# Altium project Pollux III.PrjPcb (part 1 of 2)
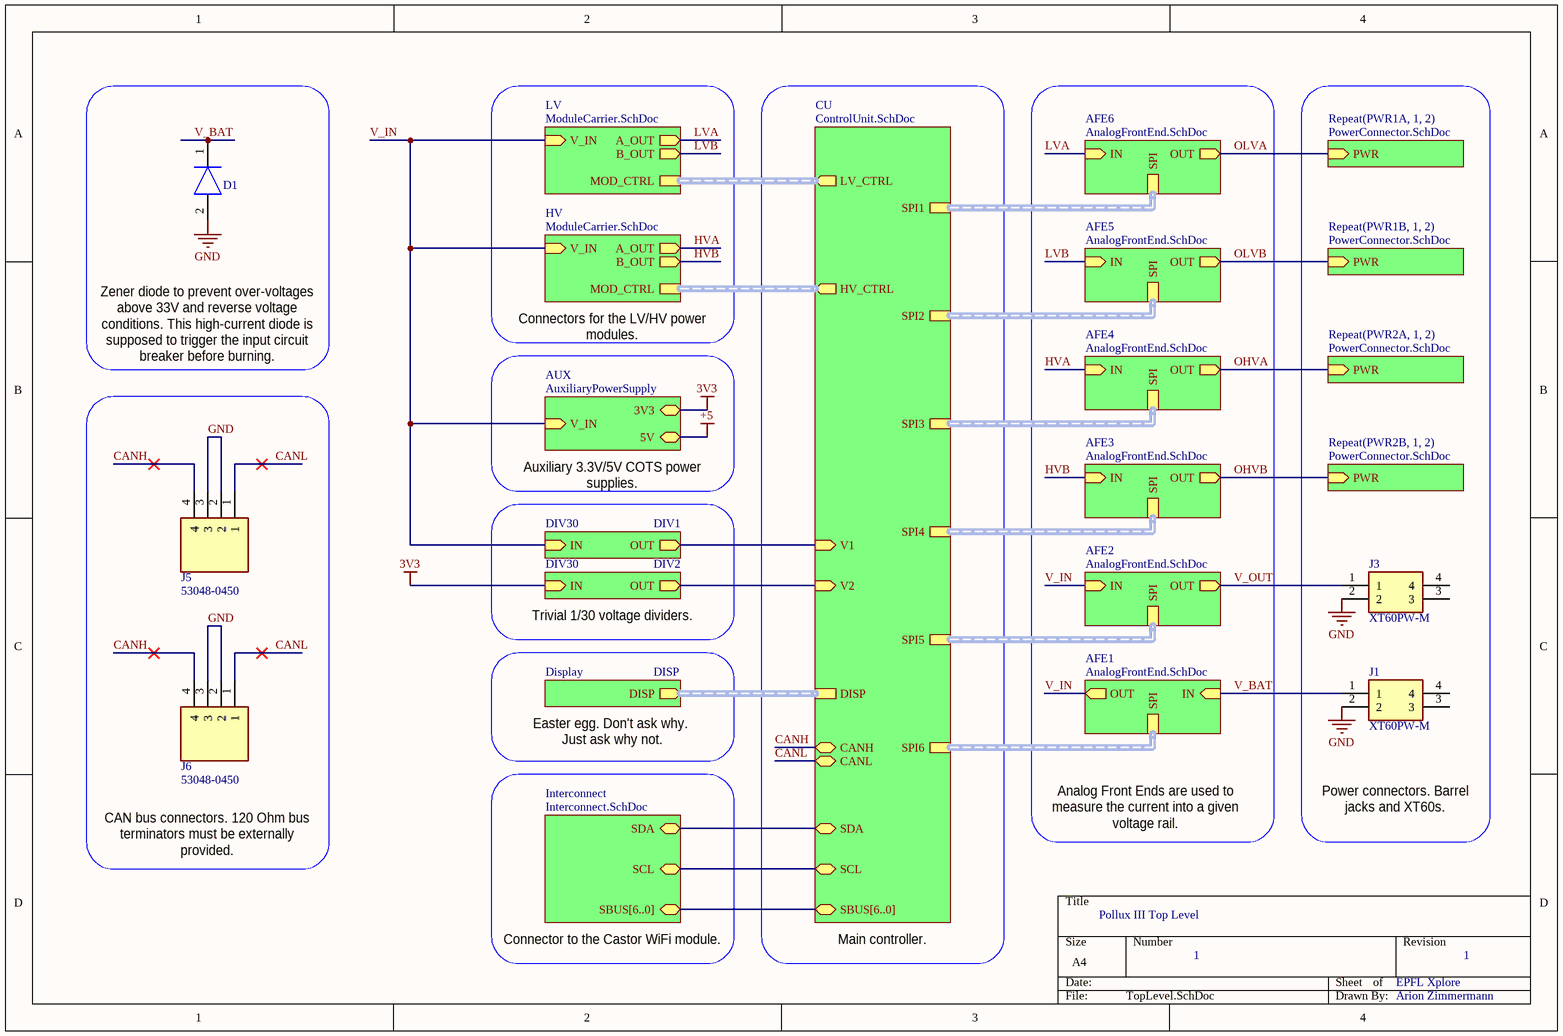
[diagram p0: TopLevel.SchDoc]
15 sheets, 118 parts. Net scope: hierarchical (ports join the sheet entries above them; power ports are global).
Board file: Pollux III.PcbDoc
Sheets:
  TopLevel.SchDoc
    LV = ModuleCarrier.SchDoc
    HV = ModuleCarrier.SchDoc
    CU = ControlUnit.SchDoc
      CTA = Controller.SchDoc
        FLASH = Flash.SchDoc
        CAN = CAN.SchDoc
        IMU = IMU.SchDoc
    DIV1 = DIV30.SchDoc
    DIV2 = DIV30.SchDoc
    AFE6 = AnalogFrontEnd.SchDoc
    PWR1A1 = PowerConnector.SchDoc
    PWR1A2 = PowerConnector.SchDoc
    PWR1B1 = PowerConnector.SchDoc
    PWR1B2 = PowerConnector.SchDoc
    PWR2A1 = PowerConnector.SchDoc
    PWR2A2 = PowerConnector.SchDoc
    PWR2B1 = PowerConnector.SchDoc
    PWR2B2 = PowerConnector.SchDoc
    AUX = AuxiliaryPowerSupply.SchDoc
    Interconnect = Interconnect.SchDoc
      LED_ST_R = LED.SchDoc
      LED_ST_G = LED.SchDoc
      LED_ST_B = LED.SchDoc
    AFE5 = AnalogFrontEnd.SchDoc
    AFE4 = AnalogFrontEnd.SchDoc
    AFE3 = AnalogFrontEnd.SchDoc
    AFE2 = AnalogFrontEnd.SchDoc
    AFE1 = AnalogFrontEnd.SchDoc
    DISP = Display.SchDoc
      AUDIO = Audio.SchDoc

## Sheet TopLevel.SchDoc
size A4; SheetNumber: 1; SheetTotal: 15

### Parts
D1  BZG03C33-HM3-08  [DIOM5127X229N]  (value not drawn)
J1  XT60PW-M  [XT60PWM]
J3  XT60PW-M  [XT60PWM]
J5  53048-0450  [SHDRRA4W35P0X125_1X4_675X550X350P]
J6  53048-0450  [SHDRRA4W35P0X125_1X4_675X550X350P]

### Sub-sheets
AFE1 = AnalogFrontEnd.SchDoc: IN (in), SPI (harness AFE_Harness), OUT (out)
AFE2 = AnalogFrontEnd.SchDoc: IN (in), SPI (harness AFE_Harness), OUT (out)
AFE3 = AnalogFrontEnd.SchDoc: IN (in), SPI (harness AFE_Harness), OUT (out)
AFE4 = AnalogFrontEnd.SchDoc: IN (in), SPI (harness AFE_Harness), OUT (out)
AFE5 = AnalogFrontEnd.SchDoc: IN (in), SPI (harness AFE_Harness), OUT (out)
AFE6 = AnalogFrontEnd.SchDoc: IN (in), SPI (harness AFE_Harness), OUT (out)
AUX = AuxiliaryPowerSupply: V_IN (in), 3V3 (bidir), 5V (bidir)
CU = ControlUnit.SchDoc: LV_CTRL (out, harness MOD_CTRL_Harness), V1 (in), V2 (in), SPI1 (harness AFE_Harness), SPI2 (harness AFE_Harness), SPI3 (harness AFE_Harness), SPI4 (harness AFE_Harness), SPI5 (harness AFE_Harness), SPI6 (harness AFE_Harness), SDA (bidir), SCL (bidir), SBUS[6..0] (bidir), CANH (bidir), CANL (bidir), HV_CTRL (out, harness MOD_CTRL_Harness), DISP (harness DISP_Harness)
DISP = Display: DISP (out, harness DISP_Harness)
DIV1 = DIV30: OUT (out), IN (in)
DIV2 = DIV30: OUT (out), IN (in)
HV = ModuleCarrier.SchDoc: A_OUT (out), V_IN (in), B_OUT (out), MOD_CTRL (harness MOD_CTRL_Harness)
Interconnect = Interconnect.SchDoc: SBUS[6..0] (bidir), SCL (bidir), SDA (bidir)
LV = ModuleCarrier.SchDoc: A_OUT (out), V_IN (in), B_OUT (out), MOD_CTRL (harness MOD_CTRL_Harness)
Repeat(PWR1A, 1, 2) = PowerConnector.SchDoc: PWR (in)
Repeat(PWR1B, 1, 2) = PowerConnector.SchDoc: PWR (in)
Repeat(PWR2A, 1, 2) = PowerConnector.SchDoc: PWR (in)
Repeat(PWR2B, 1, 2) = PowerConnector.SchDoc: PWR (in)

### Nets
3V3: sheet DIV2/IN, sheet AUX/3V3
GND: D1.2(A) J1.2 J3.2 J5.2 J5.3 J6.2 J6.3
CANH: J5.4 J6.4 ; sheet CU/CANH
CANL: J5.1 J6.1 ; sheet CU/CANL
HVA: sheet HV/A_OUT, sheet AFE4/IN
HVB: sheet HV/B_OUT, sheet AFE3/IN
LVA: sheet LV/A_OUT, sheet AFE6/IN
LVB: sheet LV/B_OUT, sheet AFE5/IN
OHVA: sheet Repeat(PWR2A, 1, 2)/PWR, sheet AFE4/OUT
OHVB: sheet Repeat(PWR2B, 1, 2)/PWR, sheet AFE3/OUT
OLVA: sheet AFE6/OUT, sheet Repeat(PWR1A, 1, 2)/PWR
OLVB: sheet Repeat(PWR1B, 1, 2)/PWR, sheet AFE5/OUT
SCL: sheet CU/SCL, sheet Interconnect/SCL
SDA: sheet CU/SDA, sheet Interconnect/SDA
V_BAT: D1.1(K) J1.1 ; sheet AFE1/IN
V_IN: sheet LV/V_IN, sheet HV/V_IN, sheet DIV1/IN, sheet AUX/V_IN, sheet AFE2/IN, sheet AFE1/OUT
V_OUT: J3.1 ; sheet AFE2/OUT
NetR9_DIV1_2: sheet CU/V1, sheet DIV1/OUT
NetR9_DIV2_2: sheet CU/V2, sheet DIV2/OUT

Not connected (* = marked no-connect by the designer): J1 3 4; J3 3 4

### Buses and harness runs
bus sheet CU/SBUS[6..0] = sheet Interconnect/SBUS[6..0]
harness sheet AFE1/SPI = sheet CU/SPI6
harness sheet AFE2/SPI = sheet CU/SPI5
harness sheet AFE3/SPI = sheet CU/SPI4
harness sheet AFE4/SPI = sheet CU/SPI3
harness sheet AFE5/SPI = sheet CU/SPI2
harness sheet AFE6/SPI = sheet CU/SPI1
harness sheet CU/DISP = sheet DISP/DISP
harness sheet CU/HV_CTRL = sheet HV/MOD_CTRL
harness sheet CU/LV_CTRL = sheet LV/MOD_CTRL

### Notes on the sheet
- Zener diode to prevent over-voltages above 33V and reverse voltage conditions. This high-current diode is supposed to trigger the input circuit breaker before burning.
- Connectors for the LV/HV power modules.
- Auxiliary 3.3V/5V COTS power supplies.
- Trivial 1/30 voltage dividers.
- Easter egg. Don't ask why.
  Just ask why not.
- Analog Front Ends are used to measure the current into a given voltage rail.
- Power connectors. Barrel jacks and XT60s.
- CAN bus connectors. 120 Ohm bus terminators must be externally provided.
- Pollux III Top Level
- Connector to the Castor WiFi module.
- Main controller.
- 1
- EPFL Xplore
- Arion Zimmermann

### Library data of the parts
D1 = BZG03C33-HM3-08: Diode; Manufacturer_Name: Vishay; Datasheet Link: https://www.arrow.com/en/products/bzg03c33-hm3-08/vishay; Height: 2.29mm; Manufacturer_Part_Number: BZG03C33-HM3-08; Mouser Part Number: 78-BZG03C33-HM3-08; Mouser Price/Stock: https://www.mouser.co.uk/ProductDetail/Vishay-Semiconductors/BZG03C33-HM3-08?qs=j%252B1pi9TdxUbhV%2FXINkfeTw%3D%3D; Arrow Part Number: BZG03C33-HM3-08; Arrow Price/Stock: https://www.arrow.com/en/products/bzg03c33-hm3-08/vishay
J1 J3 = XT60PW-M: Connector; Manufacturer_Name: Changzou Amass Elec; Datasheet Link: https://www.tme.eu/Document/9b8d0c5eb7094295f3d3112c214d3ade/XT60PW%20SPEC.pdf; Height: 8.4mm; Manufacturer_Part_Number: XT60PW-M
J5 J6 = 53048-0450: Connector; Manufacturer_Name: Molex; Datasheet Link: https://www.molex.com/pdm_docs/sd/530480450_sd.pdf; Height: 3.5mm; Manufacturer_Part_Number: 53048-0450; Mouser Part Number: 538-53048-0450; Mouser Price/Stock: https://www.mouser.co.uk/ProductDetail/Molex/53048-0450?qs=0lSvoLzn4L%252Bhzo05ywM78Q%3D%3D

## Sheet ModuleCarrier.SchDoc
size A4; SheetNumber: 2; SheetTotal: 15
Used 2 times, as channels LV, HV. Parts and nets are listed once, with the designators drawn on the sheet.
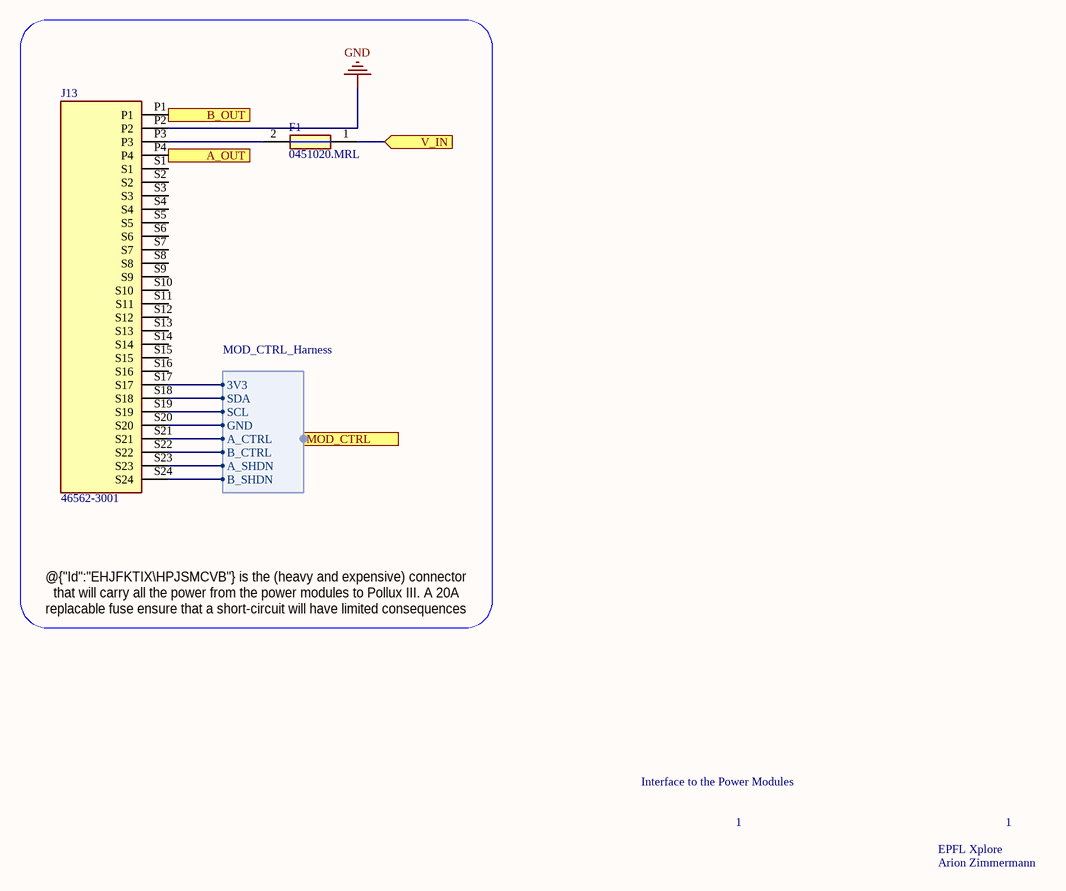
[diagram p1: ModuleCarrier.SchDoc]

### Parts
F1  0451020.MRL  [FUSC6127X294N]
J13  46562-3001  [465623001]

### Ports
A_OUT (out), B_OUT (out), MOD_CTRL (harness MOD_CTRL_Harness), V_IN (in)

### Harnesses
MOD_CTRL_Harness: B_SHDN, A_SHDN, B_CTRL, A_CTRL, GND, SCL, SDA, 3V3

### Nets
GND: J13.P2
A_OUT: J13.P4 ; port A_OUT
B_OUT: J13.P1 ; port B_OUT
V_IN: F1.1 ; port V_IN
NetF1_2: F1.2 J13.P3
NetJ13_S17: J13.S17 ; port MOD_CTRL.3V3
NetJ13_S18: J13.S18 ; port MOD_CTRL.SDA
NetJ13_S19: J13.S19 ; port MOD_CTRL.SCL
NetJ13_S20: J13.S20 ; port MOD_CTRL.GND
NetJ13_S21: J13.S21 ; port MOD_CTRL.A_CTRL
NetJ13_S22: J13.S22 ; port MOD_CTRL.B_CTRL
NetJ13_S23: J13.S23 ; port MOD_CTRL.A_SHDN
NetJ13_S24: J13.S24 ; port MOD_CTRL.B_SHDN

Not connected (* = marked no-connect by the designer): J13 S1 S2 S3 S4 S5 S6 S7 S8 S9 S10 S11 S12 S13 S14 S15 S16

### Channels
LV: designators end in _LV; ports A_OUT=LVA B_OUT=LVB V_IN=V_IN
HV: designators end in _HV; ports A_OUT=HVA B_OUT=HVB V_IN=V_IN

### Notes on the sheet
- @{"Id":"EHJFKTIX\HPJSMCVB"} is the (heavy and expensive) connector that will carry all the power from the power modules to Pollux III. A 20A replacable fuse ensure that a short-circuit will have limited consequences to the rest of the system.
- Interface to the Power Modules
- 1
- EPFL Xplore
- Arion Zimmermann

### Library data of the parts
F1 = 0451020.MRL: Fuse; Manufacturer_Name: LITTELFUSE; Datasheet Link: https://m.littelfuse.com/~/media/electronics/datasheets/fuses/littelfuse_fuse_451_453_datasheet.pdf.pdf; Height: 2.94mm; Manufacturer_Part_Number: 0451020.MRL; Mouser Part Number: 576-0451020.MRL; Mouser Price/Stock: https://www.mouser.co.uk/ProductDetail/Littelfuse/0451020MRL?qs=ZaMXuU%252B6JZZbQqgd%2F3uvYw%3D%3D; Arrow Part Number: 0451020.MRL; Arrow Price/Stock: https://www.arrow.com/en/products/0451020.mrl/littelfuse
J13 = 46562-3001: Connector; System: Connector

## Sheet ControlUnit.SchDoc
size A4; SheetNumber: 3; SheetTotal: 15
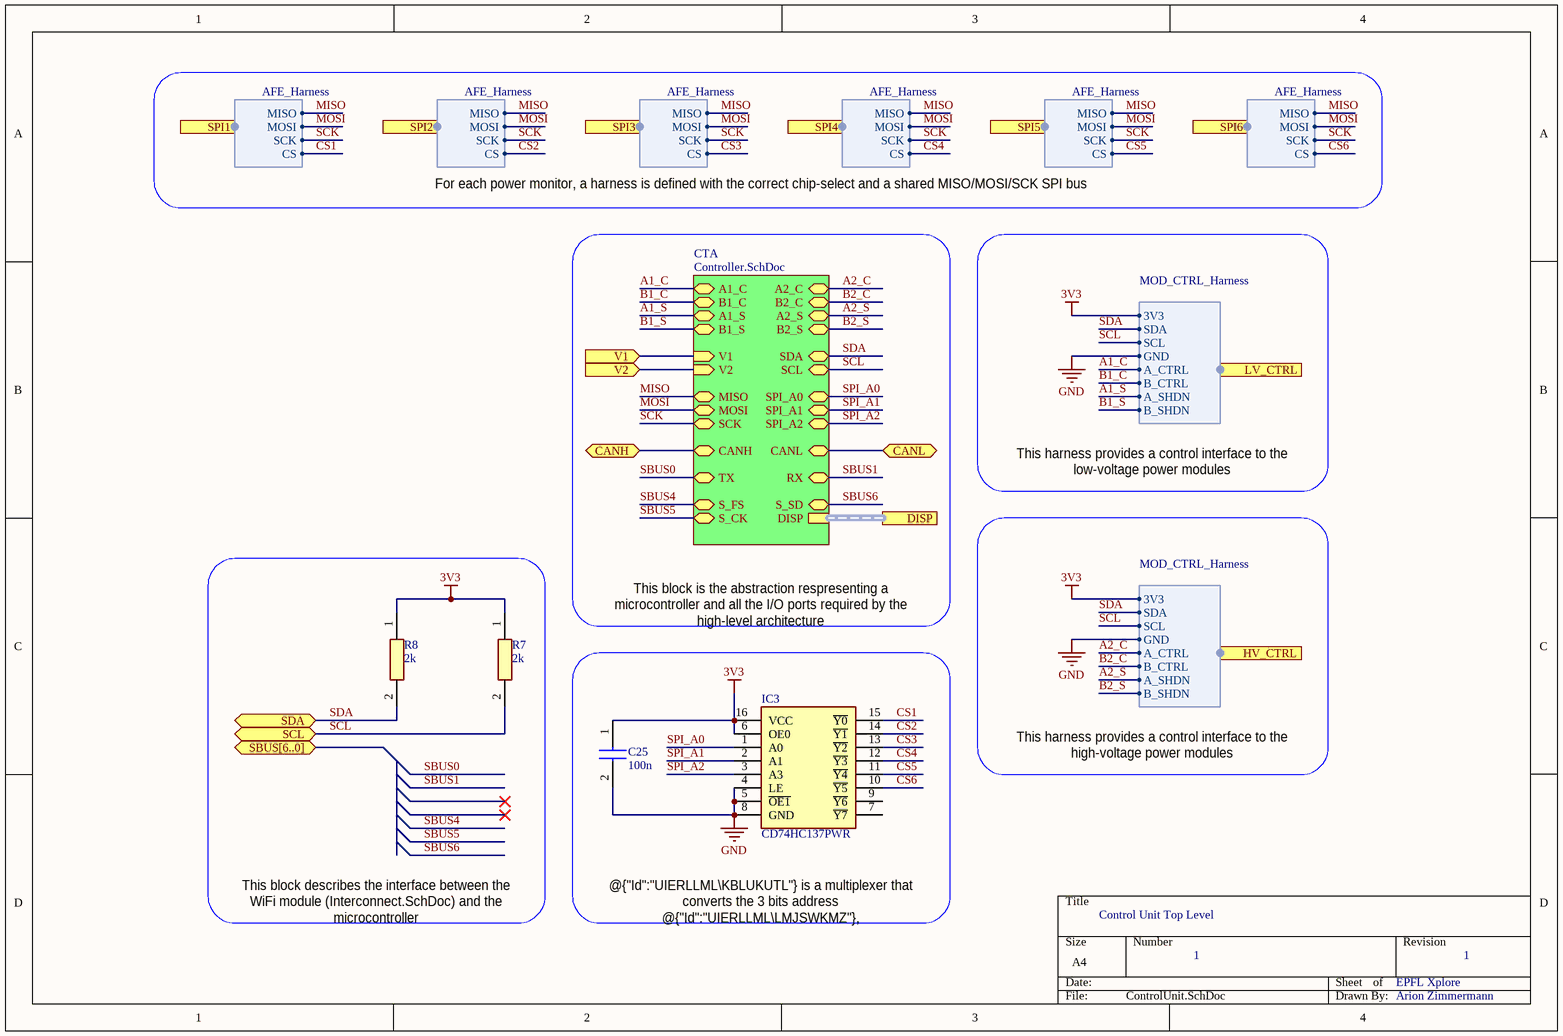
[diagram p2: ControlUnit.SchDoc]

### Parts
C25  value 100n  [CAPC1608X95N]  (hidden comment: C0603C104K5RACTU)
IC3  CD74HC137PWR  [SOP65P640X120-16N]
R7  value 2k  [RESC1608X50N]  (hidden comment: CRCW06032K00JNEB)
R8  value 2k  [RESC1608X50N]  (hidden comment: CRCW06032K00JNEB)

### Sub-sheets
CTA = Controller.SchDoc: V1 (in), V2 (in), SCL (bidir), SDA (bidir), B2_S (bidir), A2_S (bidir), B2_C (bidir), A2_C (bidir), RX (bidir), TX (bidir), MISO (bidir), MOSI (bidir), SCK (bidir), SPI_A1 (bidir), SPI_A2 (bidir), SPI_A0 (bidir), CANH (bidir), CANL (bidir), S_FS (bidir), S_CK (bidir), S_SD (bidir), B1_S (bidir), A1_S (bidir), B1_C (bidir), A1_C (bidir), DISP (harness DISP_Harness)

### Ports
CANH (bidir), CANL (bidir), DISP (harness DISP_Harness), HV_CTRL (harness MOD_CTRL_Harness), LV_CTRL (harness MOD_CTRL_Harness), SBUS[6..0] (bidir), SCL (bidir), SDA (bidir), SPI1 (harness AFE_Harness), SPI2 (harness AFE_Harness), SPI3 (harness AFE_Harness), SPI4 (harness AFE_Harness), SPI5 (harness AFE_Harness), SPI6 (harness AFE_Harness), V1 (in), V2 (in)

### Harnesses
AFE_Harness: MISO, MOSI, SCK, CS
MOD_CTRL_Harness: B_SHDN, A_SHDN, B_CTRL, A_CTRL, GND, SCL, SDA, 3V3

### Nets
3V3: C25.1 IC3.6(OE0) IC3.16(VCC) R7.1 R8.1 ; port LV_CTRL.3V3, port HV_CTRL.3V3
GND: C25.2 IC3.4(LE) IC3.5(~{OE1}) IC3.8(GND) ; port LV_CTRL.GND, port HV_CTRL.GND
A1_C: sheet CTA/A1_C, port LV_CTRL.A_CTRL
A1_S: sheet CTA/A1_S, port LV_CTRL.A_SHDN
A2_C: sheet CTA/A2_C, port HV_CTRL.A_CTRL
A2_S: sheet CTA/A2_S, port HV_CTRL.A_SHDN
B1_C: sheet CTA/B1_C, port LV_CTRL.B_CTRL
B1_S: sheet CTA/B1_S, port LV_CTRL.B_SHDN
B2_C: sheet CTA/B2_C, port HV_CTRL.B_CTRL
B2_S: sheet CTA/B2_S, port HV_CTRL.B_SHDN
CANH: port CANH, sheet CTA/CANH
CANL: port CANL, sheet CTA/CANL
CS1: IC3.15(~{Y0}) ; port SPI1.CS
CS2: IC3.14(~{Y1}) ; port SPI2.CS
CS3: IC3.13(~{Y2}) ; port SPI3.CS
CS4: IC3.12(~{Y3}) ; port SPI4.CS
CS5: IC3.11(~{Y4}) ; port SPI5.CS
CS6: IC3.10(~{Y5}) ; port SPI6.CS
MISO: sheet CTA/MISO, port SPI1.MISO, port SPI2.MISO, port SPI3.MISO, port SPI4.MISO, port SPI5.MISO, port SPI6.MISO
MOSI: sheet CTA/MOSI, port SPI1.MOSI, port SPI2.MOSI, port SPI3.MOSI, port SPI4.MOSI, port SPI5.MOSI, port SPI6.MOSI
SCK: sheet CTA/SCK, port SPI1.SCK, port SPI2.SCK, port SPI3.SCK, port SPI4.SCK, port SPI5.SCK, port SPI6.SCK
SCL: R7.2 ; port SCL, sheet CTA/SCL, port LV_CTRL.SCL, port HV_CTRL.SCL
SDA: R8.2 ; port SDA, sheet CTA/SDA, port LV_CTRL.SDA, port HV_CTRL.SDA
SPI_A0: IC3.1(A0) ; sheet CTA/SPI_A0
SPI_A1: IC3.2(A1) ; sheet CTA/SPI_A1
SPI_A2: IC3.3(A3) ; sheet CTA/SPI_A2
NetR9_DIV1_2: port V1, sheet CTA/V1
NetR9_DIV2_2: port V2, sheet CTA/V2

Not connected (* = marked no-connect by the designer): IC3 7(~{Y7}) 9(~{Y6})

### Buses and harness runs
harness port DISP = sheet CTA/DISP

### Notes on the sheet
- For each power monitor, a harness is defined with the correct chip-select and a shared MISO/MOSI/SCK SPI bus
- This harness provides a control interface to the low-voltage power modules
- This block is the abstraction respresenting a microcontroller and all the I/O ports required by the high-level architecture
- This harness provides a control interface to the high-voltage power modules
- This block describes the interface between the WiFi module (Interconnect.SchDoc) and the microcontroller
- @{"Id":"UIERLLML\KBLUKUTL"} is a multiplexer that converts the 3 bits address @{"Id":"UIERLLML\LMJSWKMZ"}, @{"Id":"UIERLLML\LQKXKBVL"}, @{"Id":"UIERLLML\IKBLSFXQ"} to a chip-select signal for the power monitors
- Control Unit Top Level
- 1
- EPFL Xplore
- Arion Zimmermann

### Library data of the parts
C25 = C0603C104K5RACTU: Capacitor; Manufacturer_Name: Kemet; Datasheet Link: http://www.farnell.com/datasheets/2205446.pdf; Height: 0.95mm; Manufacturer_Part_Number: C0603C104K5RACTU; Mouser Part Number: 80-C0603C104K5R; Mouser Price/Stock: https://www.mouser.co.uk/ProductDetail/KEMET/C0603C104K5RACTU?qs=l5k%252BbMnNDkkVcnZPSAaaiQ%3D%3D; Arrow Part Number: C0603C104K5RACTU; Arrow Price/Stock: https://www.arrow.com/en/products/c0603c104k5ractu/kemet-corporation; Supplier 1: Mouser; Supplier Part Number 1: 80-C0603C104K5R
IC3 = CD74HC137PWR: Integrated Circuit; Manufacturer_Name: Texas Instruments; Datasheet Link: http://www.ti.com/lit/gpn/cd74hc137; Height: 1.2mm; Manufacturer_Part_Number: CD74HC137PWR; Mouser Part Number: 595-CD74HC137PWR; Mouser Price/Stock: https://www.mouser.co.uk/ProductDetail/Texas-Instruments/CD74HC137PWR/?qs=YxwvVplHM%2Fm8ZkoHTCdntQ%3D%3D; Arrow Part Number: CD74HC137PWR; Arrow Price/Stock: https://www.arrow.com/en/products/cd74hc137pwr/texas-instruments; Supplier 1: Mouser; Supplier Part Number 1: 595-CD74HC137PWR
R7 R8 = CRCW0603931RFKEA: Resistor; Manufacturer_Name: Vishay; Manufacturer_Part_Number: CRCW0603787RFKEA; Datasheet Link: http://www.vishay.com/docs/20035/dcrcwe3.pdf; Height: 0.5mm; Supplier 1: Mouser; Supplier Part Number 1: 71-CRCW06032K00JNEB

## Sheet Controller.SchDoc
size A4; SheetNumber: 4; SheetTotal: 15
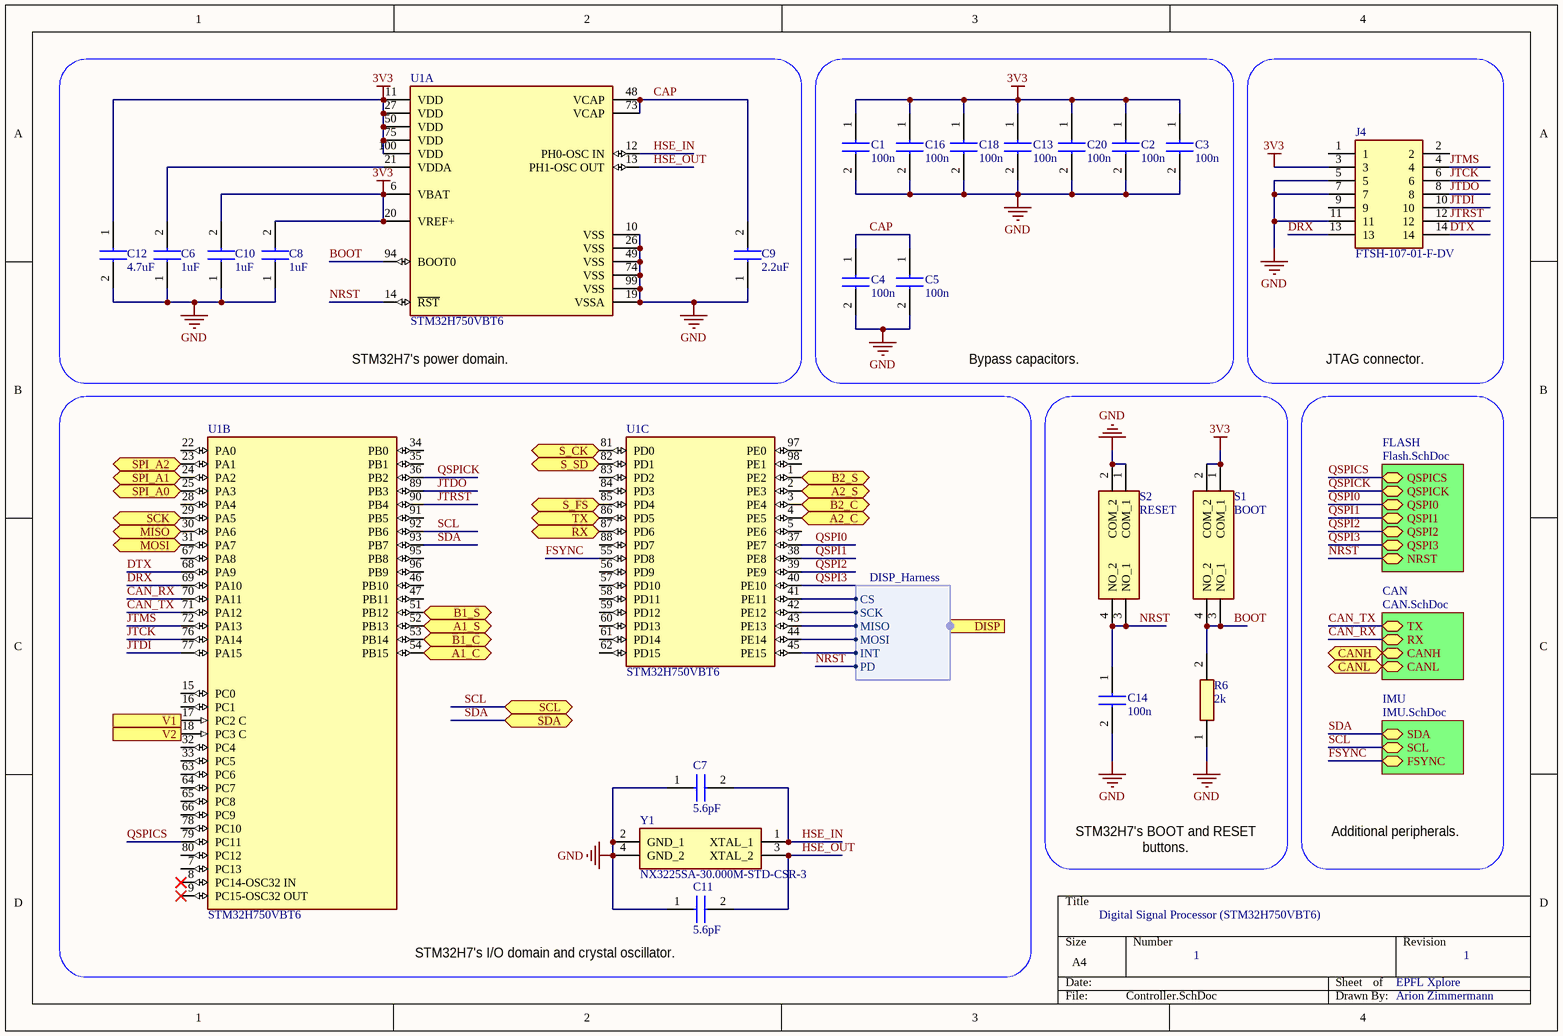
[diagram p3: Controller.SchDoc]

### Parts
C1  value 100n  [CAPC1608X95N]  (hidden comment: C0603C104K5RACTU)
C2  value 100n  [CAPC1608X95N]  (hidden comment: C0603C104K5RACTU)
C3  value 100n  [CAPC1608X95N]  (hidden comment: C0603C104K5RACTU)
C4  value 100n  [CAPC1608X95N]  (hidden comment: C0603C104K5RACTU)
C5  value 100n  [CAPC1608X95N]  (hidden comment: C0603C104K5RACTU)
C6  value 1uF  [CAPC3216X130N]  (hidden comment: C1206C105M5RECTU)
C7  value 5.6pF  [CAPC1608X87N]  (hidden comment: CBR06C569B5GAC)
C8  value 1uF  [CAPC3216X130N]  (hidden comment: C1206C105M5RECTU)
C9  value 2.2uF  [CAPC2012X140N]  (hidden comment: C0805C225K4REC7210)
C10  value 1uF  [CAPC3216X130N]  (hidden comment: C1206C105M5RECTU)
C11  value 5.6pF  [CAPC1608X87N]  (hidden comment: CBR06C569B5GAC)
C12  value 4.7uF  [CAPC2012X140N]  (hidden comment: C0805C475M4PACTU)
C13  value 100n  [CAPC1608X95N]  (hidden comment: C0603C104K5RACTU)
C14  value 100n  [CAPC1608X95N]  (hidden comment: C0603C104K5RACTU)
C16  value 100n  [CAPC1608X95N]  (hidden comment: C0603C104K5RACTU)
C18  value 100n  [CAPC1608X95N]  (hidden comment: C0603C104K5RACTU)
C20  value 100n  [CAPC1608X95N]  (hidden comment: C0603C104K5RACTU)
J4  FTSH-107-01-F-DV  [FTSH-107-XX-YYY-DV]
R6  value 2k  [RESC1608X50N]  (hidden comment: CRCW06032K00JNEB)
S1  BOOT  [LL3301FF065QJ]
S2  RESET  [LL3301FF065QJ]
U1  STM32H750VBT6  [FP-LQFP100-1L-MFG]  (parts A,B,C of 3)
Y1  NX3225SA-30.000M-STD-CSR-3  [NX2520SA192MHzEXS00ACS05400]

### Sub-sheets
CAN = CAN.SchDoc: TX (bidir), RX (bidir), CANH (bidir), CANL (bidir)
FLASH = Flash.SchDoc: QSPICS (bidir), QSPICK (bidir), QSPI0 (bidir), QSPI1 (bidir), QSPI2 (bidir), NRST (bidir), QSPI3 (bidir)
IMU = IMU.SchDoc: SDA (bidir), SCL (bidir), FSYNC (bidir)

### Ports
A1_C (bidir), A1_S (bidir), A2_C (bidir), A2_S (bidir), B1_C (bidir), B1_S (bidir), B2_C (bidir), B2_S (bidir), CANH (bidir), CANL (bidir), DISP (harness DISP_Harness), MISO (bidir), MOSI (bidir), RX (bidir), S_CK (bidir), S_FS (bidir), S_SD (bidir), SCK (bidir), SCL (bidir), SDA (bidir), SPI_A0 (bidir), SPI_A1 (bidir), SPI_A2 (bidir), TX (bidir), V1 (in), V2 (in)

### Harnesses
DISP_Harness: CS, MISO, SCK, MOSI, INT, PD

### Nets
3V3: C1.1 C2.1 C3.1 C8.2 C10.2 C12.1 C13.1 C16.1 C18.1 C20.1 J4.3 S1.1(COM_1) S1.2(COM_2) U1.6(VBAT) U1.11(VDD) U1.20(VREF+) U1.27(VDD) U1.50(VDD) U1.75(VDD) U1.100(VDD)
GND: C1.2 C2.2 C3.2 C4.2 C5.2 C6.1 C7.1 C8.1 C9.1 C10.1 C11.1 C12.2 C13.2 C14.2 C16.2 C18.2 C20.2 J4.5 J4.7 J4.11 R6.1 S2.1(COM_1) S2.2(COM_2) U1.10(VSS) U1.19(VSSA) U1.26(VSS) U1.49(VSS) U1.74(VSS) U1.99(VSS) Y1.2(GND_1) Y1.4(GND_2)
A1_C: U1.54(PB15) ; port A1_C
A1_S: U1.52(PB13) ; port A1_S
A2_C: U1.4(PE5) ; port A2_C
A2_S: U1.2(PE3) ; port A2_S
B1_C: U1.53(PB14) ; port B1_C
B1_S: U1.51(PB12) ; port B1_S
B2_C: U1.3(PE4) ; port B2_C
B2_S: U1.1(PE2) ; port B2_S
BOOT: R6.2 S1.3(NO_1) S1.4(NO_2) U1.94(BOOT0)
CAN_RX: U1.70(PA11) ; sheet CAN/RX
CAN_TX: U1.71(PA12) ; sheet CAN/TX
CANH: port CANH, sheet CAN/CANH
CANL: port CANL, sheet CAN/CANL
CAP: C4.1 C5.1 C9.2 U1.48(VCAP) U1.73(VCAP)
DCS: U1.41(PE11) ; port DISP.CS
DINT: U1.45(PE15) ; port DISP.INT
DMISO: U1.43(PE13) ; port DISP.MISO
DMOSI: U1.44(PE14) ; port DISP.MOSI
DRX: J4.13 U1.69(PA10)
DSCK: U1.42(PE12) ; port DISP.SCK
DTX: J4.14 U1.68(PA9)
FSYNC: U1.55(PD8) ; sheet IMU/FSYNC
HSE_IN: C7.2 U1.12(PH0-OSC_IN) Y1.1(XTAL_1)
HSE_OUT: C11.2 U1.13(PH1-OSC_OUT) Y1.3(XTAL_2)
JTCK: J4.6 U1.76(PA14)
JTDI: J4.10 U1.77(PA15)
JTDO: J4.8 U1.89(PB3)
JTMS: J4.4 U1.72(PA13)
JTRST: J4.12 U1.90(PB4)
MISO: U1.30(PA6) ; port MISO
MOSI: U1.31(PA7) ; port MOSI
NRST: C14.1 S2.3(NO_1) S2.4(NO_2) U1.14(~{RST}) ; sheet FLASH/NRST, port DISP.PD
QSPI0: U1.37(PE7) ; sheet FLASH/QSPI0
QSPI1: U1.38(PE8) ; sheet FLASH/QSPI1
QSPI2: U1.39(PE9) ; sheet FLASH/QSPI2
QSPI3: U1.40(PE10) ; sheet FLASH/QSPI3
QSPICK: U1.36(PB2) ; sheet FLASH/QSPICK
QSPICS: U1.79(PC11) ; sheet FLASH/QSPICS
SBUS0: U1.86(PD5) ; port TX
SBUS1: U1.87(PD6) ; port RX
SBUS4: U1.85(PD4) ; port S_FS
SBUS5: U1.81(PD0) ; port S_CK
SBUS6: U1.82(PD1) ; port S_SD
SCK: U1.29(PA5) ; port SCK
SCL: U1.92(PB6) ; port SCL, sheet IMU/SCL
SDA: U1.93(PB7) ; port SDA, sheet IMU/SDA
SPI_A0: U1.25(PA3) ; port SPI_A0
SPI_A1: U1.24(PA2) ; port SPI_A1
SPI_A2: U1.23(PA1) ; port SPI_A2
NetC6_2: C6.2 U1.21(VDDA)
NetR9_DIV1_2: U1.17(PC2_C) ; port V1
NetR9_DIV2_2: U1.18(PC3_C) ; port V2

Not connected (* = marked no-connect by the designer): J4 1 2 9; U1 5(PE6) 7(PC13) 8(PC14-OSC32_IN)* 9(PC15-OSC32_OUT)* 15(PC0) 16(PC1) 22(PA0) 28(PA4) 32(PC4) 33(PC5) 34(PB0) 35(PB1) 46(PB10) 47(PB11) 56(PD9) 57(PD10) 58(PD11) 59(PD12) 60(PD13) 61(PD14) 62(PD15) 63(PC6) 64(PC7) 65(PC8) 66(PC9) 67(PA8) 78(PC10) 80(PC12) 83(PD2) 84(PD3) 88(PD7) 91(PB5) 95(PB8) 96(PB9) 97(PE0) 98(PE1)

### Notes on the sheet
- (near U1) STM32H7's power domain.
- Bypass capacitors.
- JTAG connector.
- STM32H7's BOOT and RESET buttons.
- Additional peripherals.
- Digital Signal Processor (STM32H750VBT6)
- STM32H7's I/O domain and crystal oscillator.
- 1
- EPFL Xplore
- Arion Zimmermann

### Library data of the parts
C1-C5 C13 C14 C16 C18 C20 = C0603C104K5RACTU: Capacitor; Manufacturer_Name: Kemet; Datasheet Link: http://www.farnell.com/datasheets/2205446.pdf; Height: 0.95mm; Manufacturer_Part_Number: C0603C104K5RACTU; Mouser Part Number: 80-C0603C104K5R; Mouser Price/Stock: https://www.mouser.co.uk/ProductDetail/KEMET/C0603C104K5RACTU?qs=l5k%252BbMnNDkkVcnZPSAaaiQ%3D%3D; Arrow Part Number: C0603C104K5RACTU; Arrow Price/Stock: https://www.arrow.com/en/products/c0603c104k5ractu/kemet-corporation; Supplier 1: Mouser; Supplier Part Number 1: 80-C0603C104K5R
C6 C8 C10 = C1206C105M5RECTU: Capacitor; Manufacturer_Name: Kemet; Datasheet Link: https://content.kemet.com/datasheets/KEM_C1090_X7R_ESD.pdf; Height: 1.3mm; Manufacturer_Part_Number: C1206C105M5RECTU; Mouser Part Number: 80-C1206C105M5RECTU; Mouser Price/Stock: https://www.mouser.co.uk/ProductDetail/KEMET/C1206C105M5RECTU?qs=55YtniHzbhBh39CxZCw85g%3D%3D; Arrow Part Number: C1206C105M5RECTU; Arrow Price/Stock: https://www.arrow.com/en/products/c1206c105m5rectu/kemet-corporation; Supplier 1: Mouser; Supplier Part Number 1: 80-C1206C105M5RECTU
C7 C11 = CBR06C569B5GAC: Capacitor; Manufacturer_Name: Kemet; Datasheet Link: http://www.kemet.com/Lists/ProductCatalog/Attachments/490/KEM_C1030_CBR_SMD.pdf; Height: 0.87mm; Manufacturer_Part_Number: CBR06C569B5GAC; Mouser Part Number: 80-CBR06C569B5GAC; Mouser Price/Stock: https://www.mouser.co.uk/ProductDetail/KEMET/CBR06C569B5GAC/?qs=8sjaHP9aayqGSwkvsyWeEw%3D%3D; Arrow Part Number: CBR06C569B5GAC; Arrow Price/Stock: https://www.arrow.com/en/products/cbr06c569b5gac/kemet-corporation; Supplier 1: Mouser; Supplier Part Number 1: 80-CBR06C569B5GAC
C9 = C0805C225K4REC7210: Capacitor; Manufacturer_Name: Kemet; Datasheet Link: https://content.kemet.com/datasheets/KEM_C1090_X7R_ESD.pdf; Height: 1.4mm; Manufacturer_Part_Number: C0805C225K4REC7210; Mouser Part Number: 80-C0805C225K4RECLR; Mouser Price/Stock: https://www.mouser.co.uk/ProductDetail/KEMET/C0805C225K4REC7210?qs=55YtniHzbhCWJdUu8xFadQ%3D%3D; Supplier 1: Mouser; Supplier Part Number 1: 80-C0805C225K4RECLR
C12 = C0805C475J4RACAUTO: Capacitor; Manufacturer_Name: Kemet; Datasheet Link: https://componentsearchengine.com/Datasheets/1/C0805C475J4RACAUTO.pdf; Height: 1.4mm; Manufacturer_Part_Number: C0805C475J4RACAUTO; Mouser Part Number: 80-C0805C475J4RAUTO; Mouser Price/Stock: https://www.mouser.co.uk/ProductDetail/KEMET/C0805C475J4RACAUTO?qs=HXFqYaX1Q2zgZ196jUXcdQ%3D%3D; Arrow Part Number: C0805C475J4RACAUTO; Arrow Price/Stock: https://www.arrow.com/en/products/c0805c475j4racauto/kemet-corporation; Supplier 1: Mouser; Supplier Part Number 1: 80-C0805C475J4RAUTO
J4 = FTSH-107-01-F-DV: Connector; Manufacturer_Name: SAMTEC; Datasheet Link: http://suddendocs.samtec.com/prints/ftsh-1xx-xx-xxx-dv-xxx-xxx-mkt.pdf; Manufacturer_Part_Number: FTSH-107-01-F-DV; Mouser Part Number: 200-FTSH10701FDV; Mouser Price/Stock: https://www.mouser.co.uk/ProductDetail/Samtec/FTSH-107-01-F-DV?qs=0lQeLiL1qyalhkvT7SJ4Kw%3D%3D; Arrow Part Number: FTSH-107-01-F-DV; Arrow Price/Stock: https://www.arrow.com/en/products/ftsh-107-01-f-dv/samtec; Supplier 1: Mouser; Supplier Part Number 1: 200-FTSH10701FDV
R6 = CRCW0603931RFKEA: as R7 on sheet ControlUnit; Datasheet Link: http://www.vishay.com/docs/20035/dcrcwe3.pdf; Height: 0.5mm; Supplier 1: Mouser; Supplier Part Number 1: 71-CRCW06032K00JNEB
S1 S2 = LL3301AF065QJ: Switch; Manufacturer_Name: E-Switch; Datasheet Link: https://media.digikey.com/pdf/Data%20Sheets/E-Switch%20PDFs/LL3301AF065QJ.pdf; Height: 7.3mm; Manufacturer_Part_Number: LL3301AF065QJ; Mouser Part Number: 612-LL3301AF065QJ; Mouser Price/Stock: https://www.mouser.co.uk/ProductDetail/E-Switch/LL3301AF065QJ?qs=QtyuwXswaQi68RkbBY57jQ%3D%3D; Supplier 1: Mouser; Supplier Part Number 1: 612-LL3301AF065QJ
U1 = CMP-12105-000017-1: IC MCU 32BIT 128KB FLASH 100LQFP; Manufacturer: STMicroelectronics; Number Of Uart Channels: 9; Number Of I/Os: 82; Max Junction Temp: +125°C; Data Bus Width: 32bits; Ram Size: 1MBytes; Min Supply Voltage: 1.62V; Number Of Spi Channels: 6; Number Of Adc Channels: 36; Max Supply Voltage: 3.6V; Standoff Height: 0.05mm; Interface: I2C,SPI,UART,USART,CAN,USB,LIN,IrDA,Ethernet,I2S,Other; Number Of A/D Converters: 3; Number Of I2C Channels: 4; Memory Size: 128KBytes; Frequency: 480MHz; Number Of Timers/Counters: 20; Number Of Ethernet Channels: 1; Core Architecture: ARM Cortex-M7; Number Of Usb Channels: 2; Number Of Pwm Channels: 42; Ambient Temperature Range High: +85°C; Temperature: -40°C to +125°C; ComponentLink2URL: https://www.st.com/resource/en/datasheet/stm32h750vb.pdf; Device Class L2: Embedded Processors and Controllers; Temperature Range Low: -40°C; Octopart: https://octopart.com/stm32h750vbt6-stmicroelectronics-94048547; Category: IC; Manufacturer Part Number: STM32H750VBT6; Height: 1.6mm; Lead Free: Yes; Device Class L1: Integrated Circuits (ICs); Digikey Description: IC MCU 32BIT 128KB FLASH 100LQFP; RoHS: TRUE; Ambient Temperature Range Low: -40°C; Device Class L3: Microcontrollers; ComponentLink2Description: Datasheet; Mouser Description: MCU 32-Bit STM32H750VB ARM Cortex M7 RISC 128KB Flash 1.8V/2.5V/3.3V 100-Pin LQFP Tray; Number Of Cores: 1; Automotive: No; Memory Type: FLASH; Package: LQFP100-1L; Temperature Range High: +125°C
Y1 = NX2520SA-25.000M-STD-CSW-5: Crystal or Oscillator; Manufacturer_Name: NDK; Datasheet Link: https://kr.mouser.com/datasheet/2/905/ndk_08142018_NX2520SA-19.200000MHZ-NBG1-1389014.pdf; Height: 0.55mm; Manufacturer_Part_Number: NX2520SA-25.000M-STD-CSW-5; Mouser Part Number: 344-NX2520SA25MSTSW5; Mouser Price/Stock: https://www.mouser.co.uk/ProductDetail/NDK/NX2520SA-25000M-STD-CSW-5?qs=w%2Fv1CP2dgqoYJPVY2dD4UA%3D%3D; Supplier 1: Mouser; Supplier Part Number 1: 344-NX3225SA30MSTSR3

## Sheet Flash.SchDoc
size A4; SheetNumber: 6; SheetTotal: 15
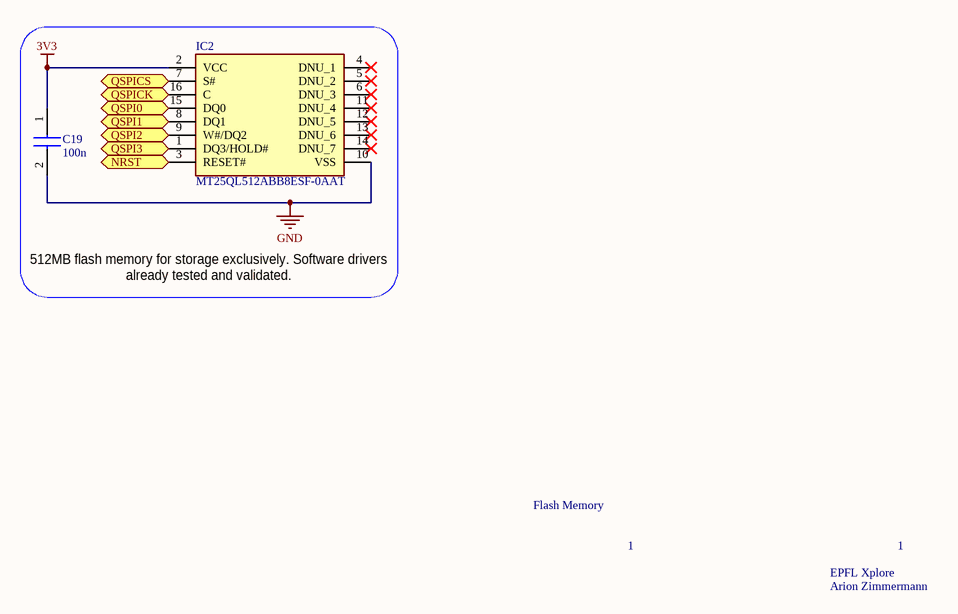
[diagram p4: Flash.SchDoc]

### Parts
C19  value 100n  [CAPC1608X95N]  (hidden comment: C0603C104K5RACTU)
IC2  MT25QL512ABB8ESF-0AAT  [SOIC127P1032X265-16N]

### Ports
NRST (bidir), QSPI0 (bidir), QSPI1 (bidir), QSPI2 (bidir), QSPI3 (bidir), QSPICK (bidir), QSPICS (bidir)

### Nets
3V3: C19.1 IC2.2(VCC)
GND: C19.2 IC2.10(VSS)
NRST: IC2.3(RESET#) ; port NRST
QSPI0: IC2.15(DQ0) ; port QSPI0
QSPI1: IC2.8(DQ1) ; port QSPI1
QSPI2: IC2.9(W#/DQ2) ; port QSPI2
QSPI3: IC2.1(DQ3/HOLD#) ; port QSPI3
QSPICK: IC2.16(C) ; port QSPICK
QSPICS: IC2.7(S#) ; port QSPICS

Not connected (* = marked no-connect by the designer): IC2 4(DNU_1)* 5(DNU_2)* 6(DNU_3)* 11(DNU_4)* 12(DNU_5)* 13(DNU_6)* 14(DNU_7)*

### Notes on the sheet
- 512MB flash memory for storage exclusively. Software drivers already tested and validated.
- Flash Memory
- 1
- EPFL Xplore
- Arion Zimmermann

### Library data of the parts
C19 = C0603C104K5RACTU: Capacitor; Manufacturer_Name: Kemet; Datasheet Link: http://www.farnell.com/datasheets/2205446.pdf; Height: 0.95mm; Manufacturer_Part_Number: C0603C104K5RACTU; Mouser Part Number: 80-C0603C104K5R; Mouser Price/Stock: https://www.mouser.co.uk/ProductDetail/KEMET/C0603C104K5RACTU?qs=l5k%252BbMnNDkkVcnZPSAaaiQ%3D%3D; Arrow Part Number: C0603C104K5RACTU; Arrow Price/Stock: https://www.arrow.com/en/products/c0603c104k5ractu/kemet-corporation; Supplier 1: Mouser; Supplier Part Number 1: 80-C0603C104K5R
IC2 = MT25QL512ABB8ESF-0AAT: Integrated Circuit; Manufacturer_Name: Micron; Datasheet Link: https://media-www.micron.com/-/media/client/global/documents/products/data-sheet/nor-flash/serial-nor/mt25q/die-rev-b/mt25q_qlkt_l_512_abb_0.pdf?rev=0ef0faa5f7b645d7bc11c30bfd27505b; Height: 2.65mm; Manufacturer_Part_Number: MT25QL512ABB8ESF-0AAT; Mouser Part Number: 340-285789-TRAY; Mouser Price/Stock: https://www.mouser.co.uk/ProductDetail/Micron/MT25QL512ABB8ESF-0AAT?qs=rrS6PyfT74da2PZ8DoLIJg%3D%3D; Arrow Part Number: MT25QL512ABB8ESF-0AAT; Arrow Price/Stock: https://www.arrow.com/en/products/mt25ql512abb8esf-0aat/micron-technology; Supplier 1: Mouser; Supplier Part Number 1: 340-285789-TRAY

## Sheet CAN.SchDoc
size A4; SheetNumber: 7; SheetTotal: 15
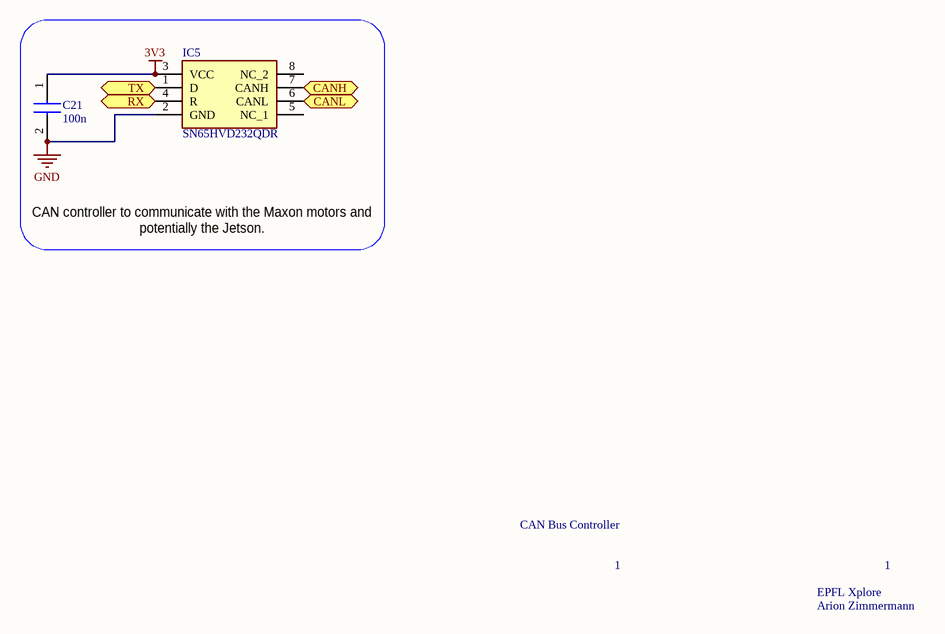
[diagram p5: CAN.SchDoc]

### Parts
C21  value 100n  [CAPC1608X95N]  (hidden comment: C0603C104K5RACTU)
IC5  SN65HVD232QDR  [SOIC127P600X175-8N]

### Ports
CANH (bidir), CANL (bidir), RX (bidir), TX (bidir)

### Nets
3V3: C21.1 IC5.3(VCC)
GND: C21.2 IC5.2(GND)
CAN_RX: IC5.4(R) ; port RX
CAN_TX: IC5.1(D) ; port TX
CANH: IC5.7(CANH) ; port CANH
CANL: IC5.6(CANL) ; port CANL

Not connected (* = marked no-connect by the designer): IC5 5(NC_1) 8(NC_2)

### Notes on the sheet
- CAN controller to communicate with the Maxon motors and potentially the Jetson.
- CAN Bus Controller
- 1
- EPFL Xplore
- Arion Zimmermann

### Library data of the parts
C21 = C0603C104K5RACTU: Capacitor; Manufacturer_Name: Kemet; Datasheet Link: http://www.farnell.com/datasheets/2205446.pdf; Height: 0.95mm; Manufacturer_Part_Number: C0603C104K5RACTU; Mouser Part Number: 80-C0603C104K5R; Mouser Price/Stock: https://www.mouser.co.uk/ProductDetail/KEMET/C0603C104K5RACTU?qs=l5k%252BbMnNDkkVcnZPSAaaiQ%3D%3D; Arrow Part Number: C0603C104K5RACTU; Arrow Price/Stock: https://www.arrow.com/en/products/c0603c104k5ractu/kemet-corporation; Supplier 1: Mouser; Supplier Part Number 1: 80-C0603C104K5R
IC5 = SN65HVD232QDR: Integrated Circuit; Manufacturer_Name: Texas Instruments; Datasheet Link: http://www.ti.com/lit/gpn/SN65HVD232Q; Height: 1.75mm; Manufacturer_Part_Number: SN65HVD232QDR; Mouser Part Number: 595-SN65HVD232QDR; Mouser Price/Stock: https://www.mouser.co.uk/ProductDetail/Texas-Instruments/SN65HVD232QDR?qs=QViXGNcIEAuDpfsGPShang%3D%3D; Arrow Part Number: SN65HVD232QDR; Arrow Price/Stock: https://www.arrow.com/en/products/sn65hvd232qdr/texas-instruments?region=nac

## Sheet IMU.SchDoc
size A4; SheetNumber: 5; SheetTotal: 15
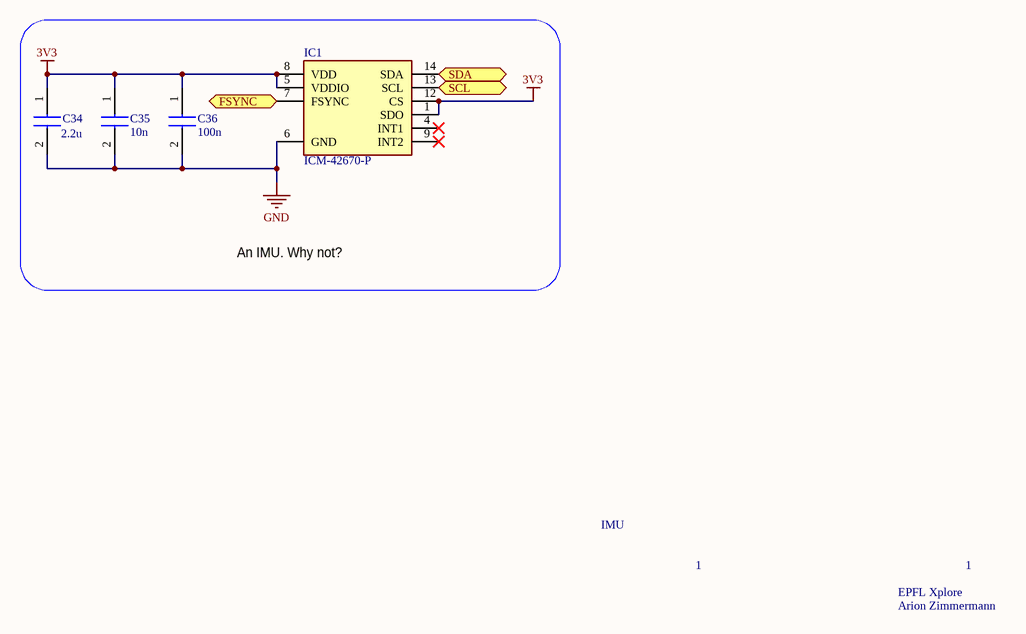
[diagram p6: IMU.SchDoc]

### Parts
C34  value 2.2u  [C1206]  (hidden comment: C1206J225J4RACAUTO)
C35  value 10n  [CAPC1608X95N]  (hidden comment: C0603C103K5RACTU)
C36  value 100n  [CAPC1608X95N]  (hidden comment: C0603C104K5RACTU)
IC1  ICM-42670-P  [ICM42670P]

### Ports
FSYNC (bidir), SCL (bidir), SDA (bidir)

### Nets
3V3: C34.1 C35.1 C36.1 IC1.1(SDO) IC1.5(VDDIO) IC1.8(VDD) IC1.12(CS)
GND: C34.2 C35.2 C36.2 IC1.6(GND)
FSYNC: IC1.7(FSYNC) ; port FSYNC
SCL: IC1.13(SCL) ; port SCL
SDA: IC1.14(SDA) ; port SDA

Not connected (* = marked no-connect by the designer): IC1 4(INT1)* 9(INT2)*

### Notes on the sheet
- An IMU. Why not?
- IMU
- 1
- EPFL Xplore
- Arion Zimmermann

### Library data of the parts
C34 = C1206C106K4RACTU: Capacitor; Manufacturer_Name: Kemet; Datasheet Link: https://content.kemet.com/datasheets/KEM_C1002_X7R_SMD.pdf; Manufacturer_Part_Number: C1206C106K4RACTU; Mouser Part Number: 80-C1206C106K4R; Mouser Price/Stock: https://www.mouser.co.uk/ProductDetail/KEMET/C1206C106K4RACTU?qs=guDyKOyRtV0mxqxQedB7kA%3D%3D; Arrow Part Number: C1206C106K4RACTU; Arrow Price/Stock: https://www.arrow.com/en/products/c1206c106k4ractu/kemet-corporation
C35 C36 = C0603C104K5RACTU: Capacitor; Manufacturer_Name: Kemet; Datasheet Link: http://www.farnell.com/datasheets/2205446.pdf; Height: 0.95mm; Manufacturer_Part_Number: C0603C104K5RACTU; Mouser Part Number: 80-C0603C104K5R; Mouser Price/Stock: https://www.mouser.co.uk/ProductDetail/KEMET/C0603C104K5RACTU?qs=l5k%252BbMnNDkkVcnZPSAaaiQ%3D%3D; Arrow Part Number: C0603C104K5RACTU; Arrow Price/Stock: https://www.arrow.com/en/products/c0603c104k5ractu/kemet-corporation; Supplier 1: Mouser; Supplier Part Number 1: 80-C0603C104K5R
IC1 = ICM-42670-P: Integrated Circuit; Manufacturer_Name: TDK; Datasheet Link: https://3cfeqx1hf82y3xcoull08ihx-wpengine.netdna-ssl.com/wp-content/uploads/2021/07/DS-000451-ICM-42670-P-v1.0.pdf; Manufacturer_Part_Number: ICM-42670-P; Mouser Part Number: 410-ICM-42670-P; Mouser Price/Stock: https://www.mouser.co.uk/ProductDetail/TDK-InvenSense/ICM-42670-P?qs=iLbezkQI%252BsgK8sMF5V7fQQ%3D%3D; Arrow Part Number: ICM-42670-P; Arrow Price/Stock: https://www.arrow.com/en/products/icm-42670-p/invensense?region=nac

## Sheet DIV30.SchDoc
size A4; SheetNumber: 8; SheetTotal: 15
Used 2 times, as channels DIV1, DIV2. Parts and nets are listed once, with the designators drawn on the sheet.
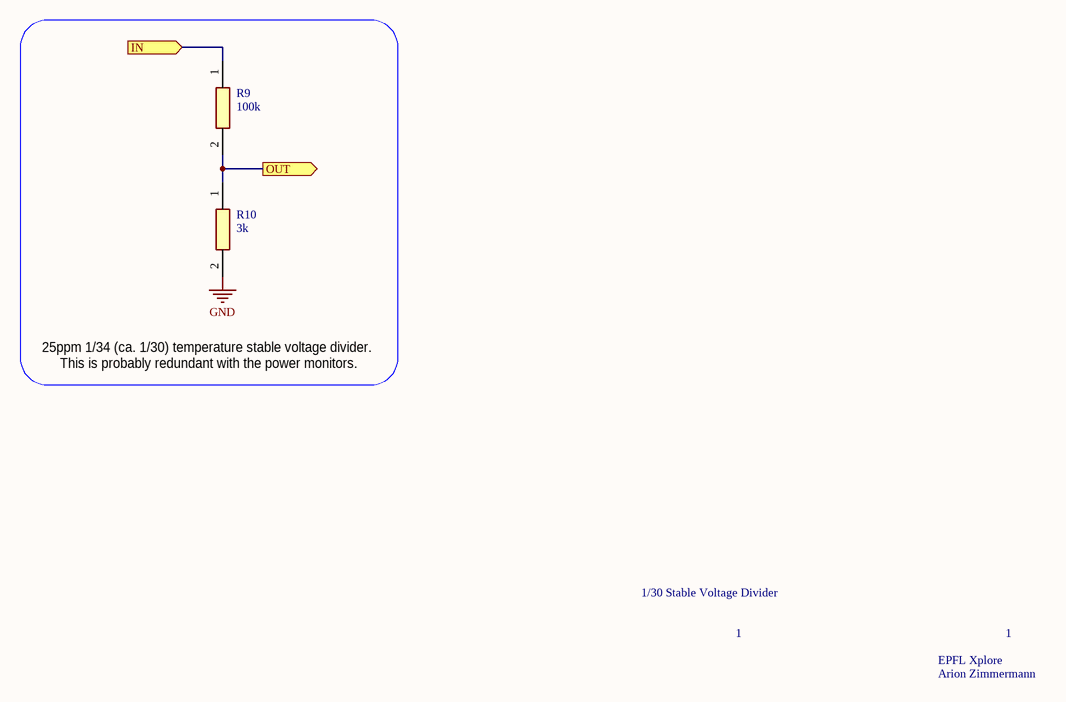
[diagram p7: DIV30.SchDoc]

### Parts
R9  value 100k  [RESC1608X55N]  (hidden comment: TNPW0603100KBEEA)
R10  value 3k  [RESC1608X55N]  (hidden comment: TNPW06033K00BEEA)

### Ports
IN (in), OUT (out)

### Nets
GND: R10.2
IN: R9.1 ; port IN
OUT: R9.2 R10.1 ; port OUT

### Channels
DIV1: designators end in _DIV1; ports IN=V_IN OUT=NetR9_DIV1_2
DIV2: designators end in _DIV2; ports IN=3V3 OUT=NetR9_DIV2_2

### Notes on the sheet
- 25ppm 1/34 (ca. 1/30) temperature stable voltage divider.
  This is probably redundant with the power monitors.
- 1/30 Stable Voltage Divider
- 1
- EPFL Xplore
- Arion Zimmermann

### Library data of the parts
R9 = TNPW0603100KBEEA: Resistor; Manufacturer_Name: Vishay; Datasheet Link: https://datasheet.datasheetarchive.com/originals/distributors/DKDS41/DSANUWW0030147.pdf; Height: 0.55mm; Manufacturer_Part_Number: TNPW0603100KBEEA
R10 = TNPW06033K00BEEA: Resistor; Manufacturer_Name: Vishay; Datasheet Link: http://www.vishay.com/docs/28758/tnpw_e3.pdf; Height: 0.55mm; Manufacturer_Part_Number: TNPW06033K00BEEA; Mouser Part Number: 71-TNPW06033K00BEEA; Mouser Price/Stock: https://www.mouser.co.uk/ProductDetail/Vishay-Dale/TNPW06033K00BEEA?qs=kHCK1FE53PnaIDT%252BQ71GHQ%3D%3D

## Sheet AnalogFrontEnd.SchDoc
size A4; SheetNumber: 9; SheetTotal: 15
Used 6 times, as channels AFE6, AFE5, AFE4, AFE3, AFE2, AFE1. Parts and nets are listed once, with the designators drawn on the sheet.
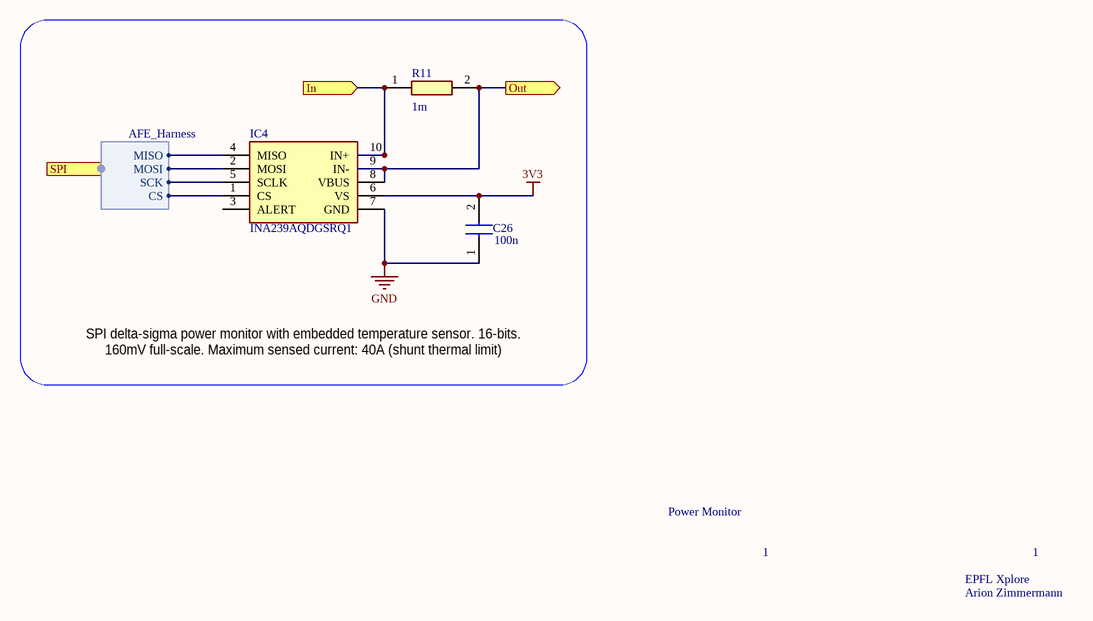
[diagram p8: AnalogFrontEnd.SchDoc]

### Parts
C26  value 100n  [CAPC1608X95N]  (hidden comment: C0603C104K5RACTU)
IC4  INA239AQDGSRQ1  [SOP50P490X110-10N]
R11  value 1m  [RESC6430X90N]  (hidden comment: PCS2512FR0010ET)

### Ports
In (in), Out (out), SPI (harness AFE_Harness)

### Harnesses
AFE_Harness: SCK, MISO, MOSI, CS

### Nets
3V3: C26.2 IC4.6(VS)
GND: C26.1 IC4.7(GND)
In: IC4.10(IN+) R11.1 ; port In
Out: IC4.8(VBUS) IC4.9(IN-) R11.2 ; port Out
NetIC4_1: IC4.1(CS) ; port SPI.CS
NetIC4_2: IC4.2(MOSI) ; port SPI.MOSI
NetIC4_4: IC4.4(MISO) ; port SPI.MISO
NetIC4_5: IC4.5(SCLK) ; port SPI.SCK

Not connected (* = marked no-connect by the designer): IC4 3(ALERT)

### Channels
AFE6: designators end in _AFE6; ports In=LVA Out=OLVA
AFE5: designators end in _AFE5; ports In=LVB Out=OLVB
AFE4: designators end in _AFE4; ports In=HVA Out=OHVA
AFE3: designators end in _AFE3; ports In=HVB Out=OHVB
AFE2: designators end in _AFE2; ports In=V_IN Out=V_OUT
AFE1: designators end in _AFE1; ports In=V_BAT Out=V_IN

### Notes on the sheet
- SPI delta-sigma power monitor with embedded temperature sensor. 16-bits. 160mV full-scale. Maximum sensed current: 40A (shunt thermal limit)
- Power Monitor
- 1
- EPFL Xplore
- Arion Zimmermann

### Library data of the parts
C26 = C0603C104K5RACTU: Capacitor; Manufacturer_Name: Kemet; Datasheet Link: http://www.farnell.com/datasheets/2205446.pdf; Height: 0.95mm; Manufacturer_Part_Number: C0603C104K5RACTU; Mouser Part Number: 80-C0603C104K5R; Mouser Price/Stock: https://www.mouser.co.uk/ProductDetail/KEMET/C0603C104K5RACTU?qs=l5k%252BbMnNDkkVcnZPSAaaiQ%3D%3D; Arrow Part Number: C0603C104K5RACTU; Arrow Price/Stock: https://www.arrow.com/en/products/c0603c104k5ractu/kemet-corporation; Supplier 1: Mouser; Supplier Part Number 1: 80-C0603C104K5R
IC4 = INA229AQDGSRQ1: Integrated Circuit; Manufacturer_Name: Texas Instruments; Datasheet Link: https://www.ti.com/lit/ds/symlink/ina229-q1.pdf?ts=1625593362739; Height: 1.1mm; Manufacturer_Part_Number: INA229AQDGSRQ1; Mouser Part Number: 595-INA229AQDGSRQ1; Mouser Price/Stock: https://www.mouser.co.uk/ProductDetail/Texas-Instruments/INA229AQDGSRQ1?qs=QNEnbhJQKvYTGkxSAfXBrQ%3D%3D; Arrow Part Number: INA229AQDGSRQ1; Arrow Price/Stock: https://www.arrow.com/en/products/ina229aqdgsrq1/texas-instruments?region=nac; Supplier 1: Mouser; Supplier Part Number 1: 595-INA239AQDGSRQ1
R11 = PCS2512FR0010ET: Resistor; Manufacturer_Name: Ohmite; Datasheet Link: https://www.mouser.com/datasheet/2/303/res_pcs-1665423.pdf; Height: 0.904mm; Manufacturer_Part_Number: PCS2512FR0010ET; Mouser Part Number: 588-PCS2512FR0010ET; Mouser Price/Stock: https://www.mouser.co.uk/ProductDetail/Ohmite/PCS2512FR0010ET?qs=Zz7%252BYVVL6bExv9xLWZznUg%3D%3D

## Sheet PowerConnector.SchDoc
size A4; SheetNumber: 12; SheetTotal: 15
Used 8 times, as channels PWR1A1, PWR1A2, PWR1B1, PWR1B2, PWR2A1, PWR2A2, PWR2B1, PWR2B2. Parts and nets are listed once, with the designators drawn on the sheet.
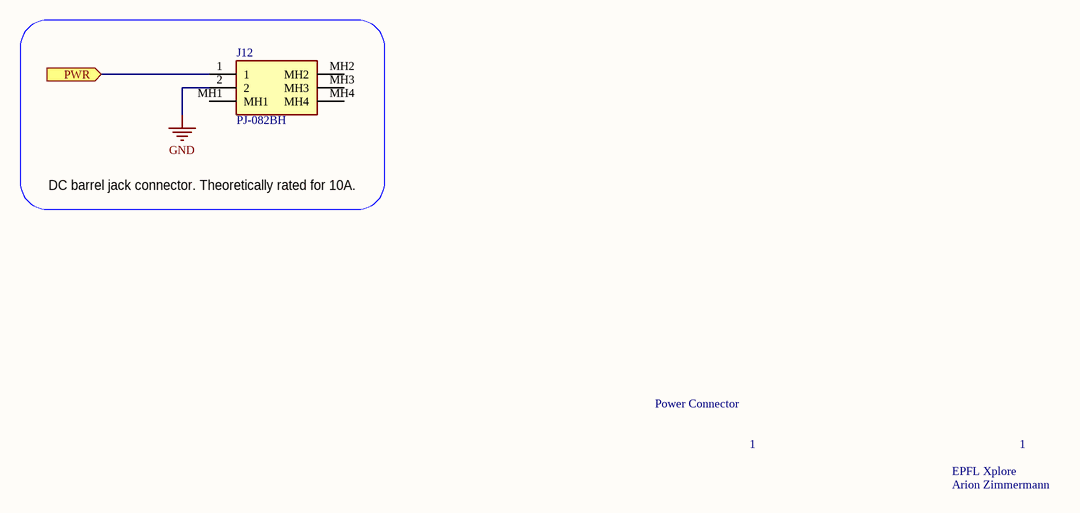
[diagram p9: PowerConnector.SchDoc]

### Parts
J12  PJ-082BH  [PJ082BH]

### Ports
PWR (in)

### Nets
GND: J12.2
PWR: J12.1 ; port PWR

Not connected (* = marked no-connect by the designer): J12 MH1 MH2 MH3 MH4

### Channels
PWR1A1: designators end in _PWR1A1; ports PWR=OLVA
PWR1A2: designators end in _PWR1A2; ports PWR=OLVA
PWR1B1: designators end in _PWR1B1; ports PWR=OLVB
PWR1B2: designators end in _PWR1B2; ports PWR=OLVB
PWR2A1: designators end in _PWR2A1; ports PWR=OHVA
PWR2A2: designators end in _PWR2A2; ports PWR=OHVA
PWR2B1: designators end in _PWR2B1; ports PWR=OHVB
PWR2B2: designators end in _PWR2B2; ports PWR=OHVB

### Notes on the sheet
- DC barrel jack connector. Theoretically rated for 10A.
- Power Connector
- 1
- EPFL Xplore
- Arion Zimmermann

### Library data of the parts
J12 = PJ-082BH: Connector; Manufacturer_Name: CUI Inc.; Datasheet Link: https://www.mouser.co.uk/datasheet/2/670/pj_082bh-1779031.pdf; Height: 10.2mm; Manufacturer_Part_Number: PJ-082BH; Mouser Part Number: 490-PJ-082BH; Mouser Price/Stock: https://www.mouser.co.uk/ProductDetail/CUI-Devices/PJ-082BH?qs=WyjlAZoYn52P2Lo8hPB1tg%3D%3D; Arrow Part Number: PJ-082BH; Arrow Price/Stock: https://www.arrow.com/en/products/pj-082bh/cui-devices?region=nac; Supplier 1: Mouser; Supplier Part Number 1: 490-PJ-082BH

## Sheet AuxiliaryPowerSupply.SchDoc
size A4; SheetNumber: 13; SheetTotal: 15
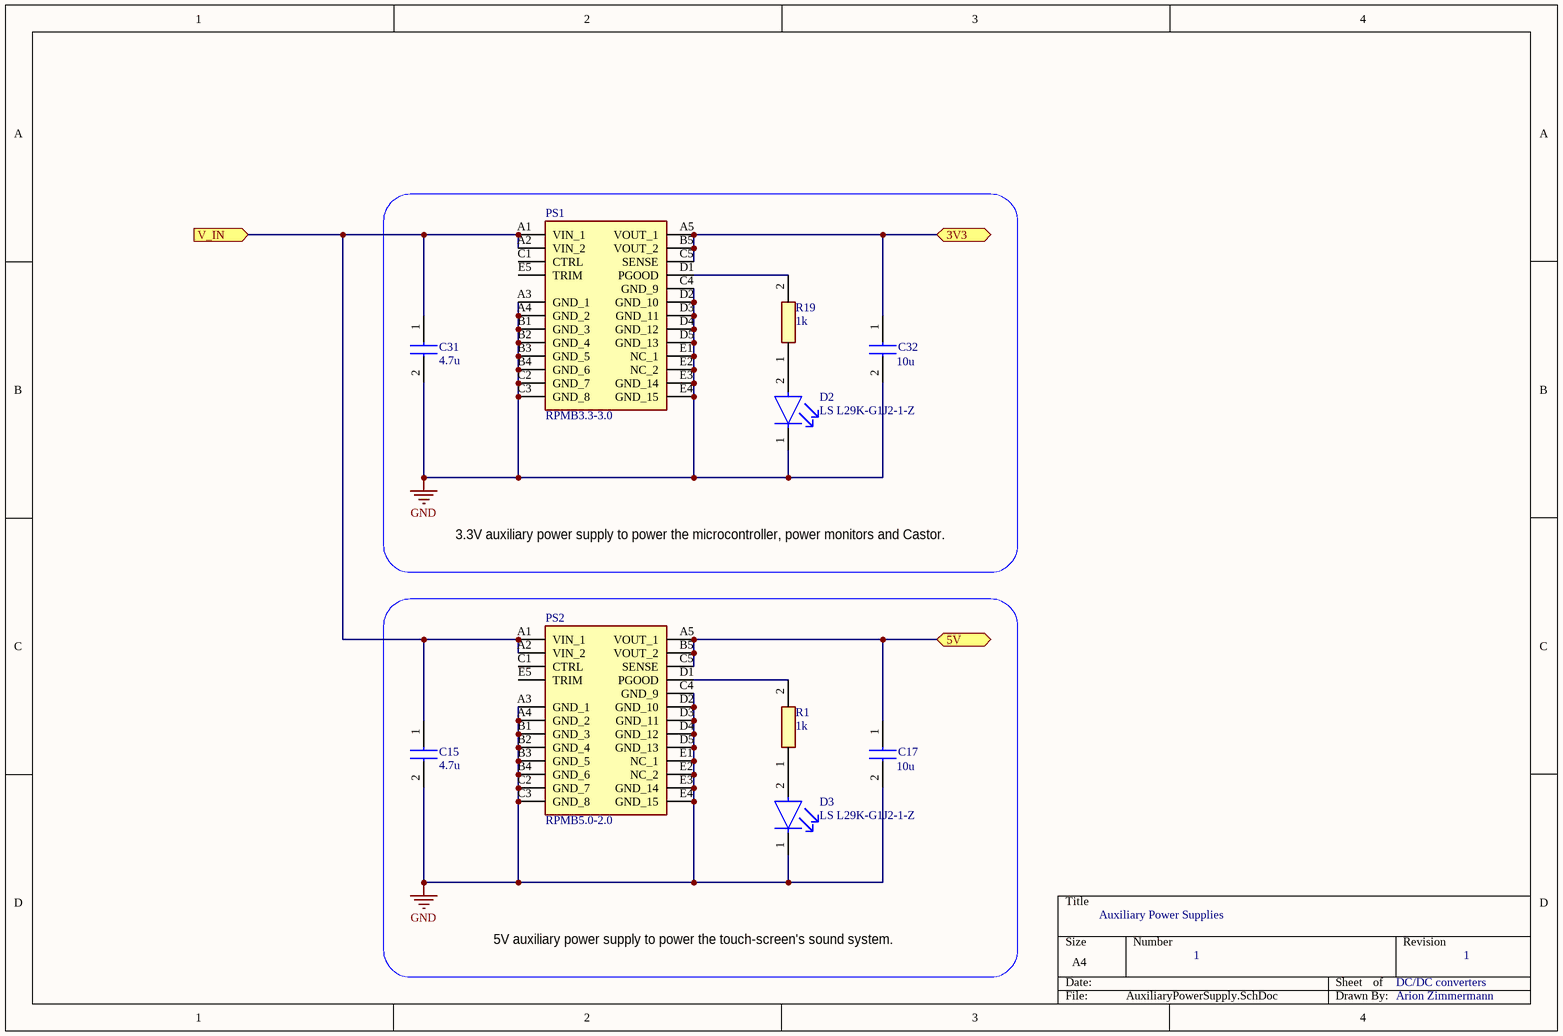
[diagram p10: AuxiliaryPowerSupply.SchDoc]

### Parts
C15  value 4.7u  [CAPC5750X310N]  (hidden comment: C5750JB2A475M230KA)
C17  value 10u  [C1206]  (hidden comment: C1206C106K4RACTU)
C31  value 4.7u  [CAPC5750X310N]  (hidden comment: C5750JB2A475M230KA)
C32  value 10u  [C1206]  (hidden comment: C1206C106K4RACTU)
D2  LS L29K-G1J2-1-Z  [FP-LS_L29K-MFG]
D3  LS L29K-G1J2-1-Z  [FP-LS_L29K-MFG]
PS1  RPMB3.3-3.0  [RPMB5030]
PS2  RPMB5.0-2.0  [RPMB5020]
R1  value 1k  [RESC1608X55N]  (hidden comment: CRCW06031K00JNEAC)
R19  value 1k  [RESC1608X55N]  (hidden comment: CRCW06031K00JNEAC)

### Ports
3V3 (bidir), 5V (bidir), V_IN (in)

### Nets
3V3: C32.1 PS1.A5(VOUT_1) PS1.B5(VOUT_2) PS1.C5(SENSE) ; port 3V3
+5: C17.1 PS2.A5(VOUT_1) PS2.B5(VOUT_2) PS2.C5(SENSE) ; port 5V
GND: C15.2 C17.2 C31.2 C32.2 D2.1(C) D3.1(C) PS1.A3(GND_1) PS1.A4(GND_2) PS1.B1(GND_3) PS1.B2(GND_4) PS1.B3(GND_5) PS1.B4(GND_6) PS1.C2(GND_7) PS1.C3(GND_8) PS1.C4(GND_9) PS1.D2(GND_10) PS1.D3(GND_11) PS1.D4(GND_12) PS1.D5(GND_13) PS1.E1(NC_1) PS1.E2(NC_2) PS1.E3(GND_14) PS1.E4(GND_15) PS2.A3(GND_1) PS2.A4(GND_2) PS2.B1(GND_3) PS2.B2(GND_4) PS2.B3(GND_5) PS2.B4(GND_6) PS2.C2(GND_7) PS2.C3(GND_8) PS2.C4(GND_9) PS2.D2(GND_10) PS2.D3(GND_11) PS2.D4(GND_12) PS2.D5(GND_13) PS2.E1(NC_1) PS2.E2(NC_2) PS2.E3(GND_14) PS2.E4(GND_15)
V_IN: C15.1 C31.1 PS1.A1(VIN_1) PS1.A2(VIN_2) PS2.A1(VIN_1) PS2.A2(VIN_2) ; port V_IN
NetD2_2: D2.2(A) R19.1
NetD3_2: D3.2(A) R1.1
NetPS1_D1: PS1.D1(PGOOD) R19.2
NetPS2_D1: PS2.D1(PGOOD) R1.2

Not connected (* = marked no-connect by the designer): PS1 C1(CTRL) E5(TRIM); PS2 C1(CTRL) E5(TRIM)

### Notes on the sheet
- 3.3V auxiliary power supply to power the microcontroller, power monitors and Castor.
- Auxiliary Power Supplies
- 5V auxiliary power supply to power the touch-screen's sound system.
- 1
- DC/DC converters
- Arion Zimmermann

### Library data of the parts
C15 C31 = C5750X7R2A475K230KA: Capacitor; Manufacturer_Name: TDK; Datasheet Link: https://product.tdk.com/de/search/capacitor/ceramic/mlcc/info?part_no=C5750X7R2A475K230KA; Height: 3.1mm; Manufacturer_Part_Number: C5750X7R2A475K230KA; Mouser Part Number: 810-C5750X7R2A475K; Mouser Price/Stock: https://www.mouser.co.uk/ProductDetail/TDK/C5750X7R2A475K230KA?qs=NRhsANhppD88FUXESCqIJQ%3D%3D; Arrow Part Number: C5750X7R2A475K230KA; Arrow Price/Stock: https://www.arrow.com/en/products/c5750x7r2a475k230ka/tdk; Supplier 1: Mouser; Supplier Part Number 1: 810-C5750JB2A475M23A
C17 C32 = C1206C106K4RACTU: Capacitor; Manufacturer_Name: Kemet; Datasheet Link: https://content.kemet.com/datasheets/KEM_C1002_X7R_SMD.pdf; Manufacturer_Part_Number: C1206C106K4RACTU; Mouser Part Number: 80-C1206C106K4R; Mouser Price/Stock: https://www.mouser.co.uk/ProductDetail/KEMET/C1206C106K4RACTU?qs=guDyKOyRtV0mxqxQedB7kA%3D%3D; Arrow Part Number: C1206C106K4RACTU; Arrow Price/Stock: https://www.arrow.com/en/products/c1206c106k4ractu/kemet-corporation
D2 D3 = CMP-62016-000014-1: LED RED DIFFUSED 0603 SMD; Manufacturer: Osram Opto; Luminous Flux: 0.0081/0.0254lm; Forward Voltage: 1.8V; Luminous Intensity: 1.8-2.24/5.6-7.1mcd; Reverse Voltage: 12V; Peak Emmision Wavelength: 643nm; Max Junction Temp: +110°C; Viewing Angle: 160°; Wavelength: 630nm; Forward Current: 2mA; Led Orientation: Top View; Category: Diode; Temperature Range High: +100°C; Automotive: No; Temperature: -40°C to +100°C; Device Class L3: unset; Mouser Description: LED Uni-Color Red 643nm Automotive 2-Pin SMD T/R; Manufacturer Part Number: LS L29K-G1J2-1-Z; ComponentLink2Description: Datasheet; Lead Free: Yes; Device Class L2: LEDs; ComponentLink2URL: https://dammedia.osram.info/media/resource/hires/osram-dam-5662679/LS%20L29K_EN.pdf; Temperature Range Low: -40°C; RoHS: TRUE; Digikey Description: LED RED DIFFUSED 0603 SMD; Colour: Red; Device Class L1: Optoelectronics; Package: LS_L29K; Octopart: https://octopart.com/ls+l29k-g1j2-1-z-osram+opto-31093939; Height: 0.67mm
PS1 = RPMB5.0-3.0: Power Supply; Manufacturer_Name: RECOM Power; Datasheet Link: https://componentsearchengine.com/Datasheets/1/RPMB5.0-3.0.pdf; Height: 3.75mm; Manufacturer_Part_Number: RPMB5.0-3.0; Mouser Part Number: 919-RPMB5.0-3.0; Mouser Price/Stock: https://www.mouser.co.uk/ProductDetail/RECOM-Power/RPMB50-30?qs=wnTfsH77Xs7FdqATAuFwWQ%3D%3D; Supplier 1: Mouser; Supplier Part Number 1: 919-RPMB3.3-3.0
PS2 = RPMB5.0-2.0: Power Supply; Manufacturer_Name: RECOM Power; Datasheet Link: https://g.recomcdn.com/media/Datasheet/pdf/.f_GMSoRX/.t173c310db6f6fe5108a0/Datasheet-322/RPMB-2_0.pdf; Height: 4mm; Manufacturer_Part_Number: RPMB5.0-2.0
R1 R19 = CRCW06031K00JNEAC: Resistor; Manufacturer_Name: Vishay; Datasheet Link: http://www.vishay.com/docs/28773/crcwce3.pdf; Height: 0.55mm; Manufacturer_Part_Number: CRCW06031K00JNEAC; Mouser Part Number: 71-CRCW06031K00JNEAC; Mouser Price/Stock: https://www.mouser.co.uk/ProductDetail/Vishay-Dale/CRCW06031K00JNEAC?qs=E3Y5ESvWgWPM5t3DlmyFHQ%3D%3D; Arrow Part Number: CRCW06031K00JNEAC; Arrow Price/Stock: https://www.arrow.com/en/products/crcw06031k00jneac/vishay?region=nac

## Sheet Interconnect.SchDoc
size A4; SheetNumber: 10; SheetTotal: 15
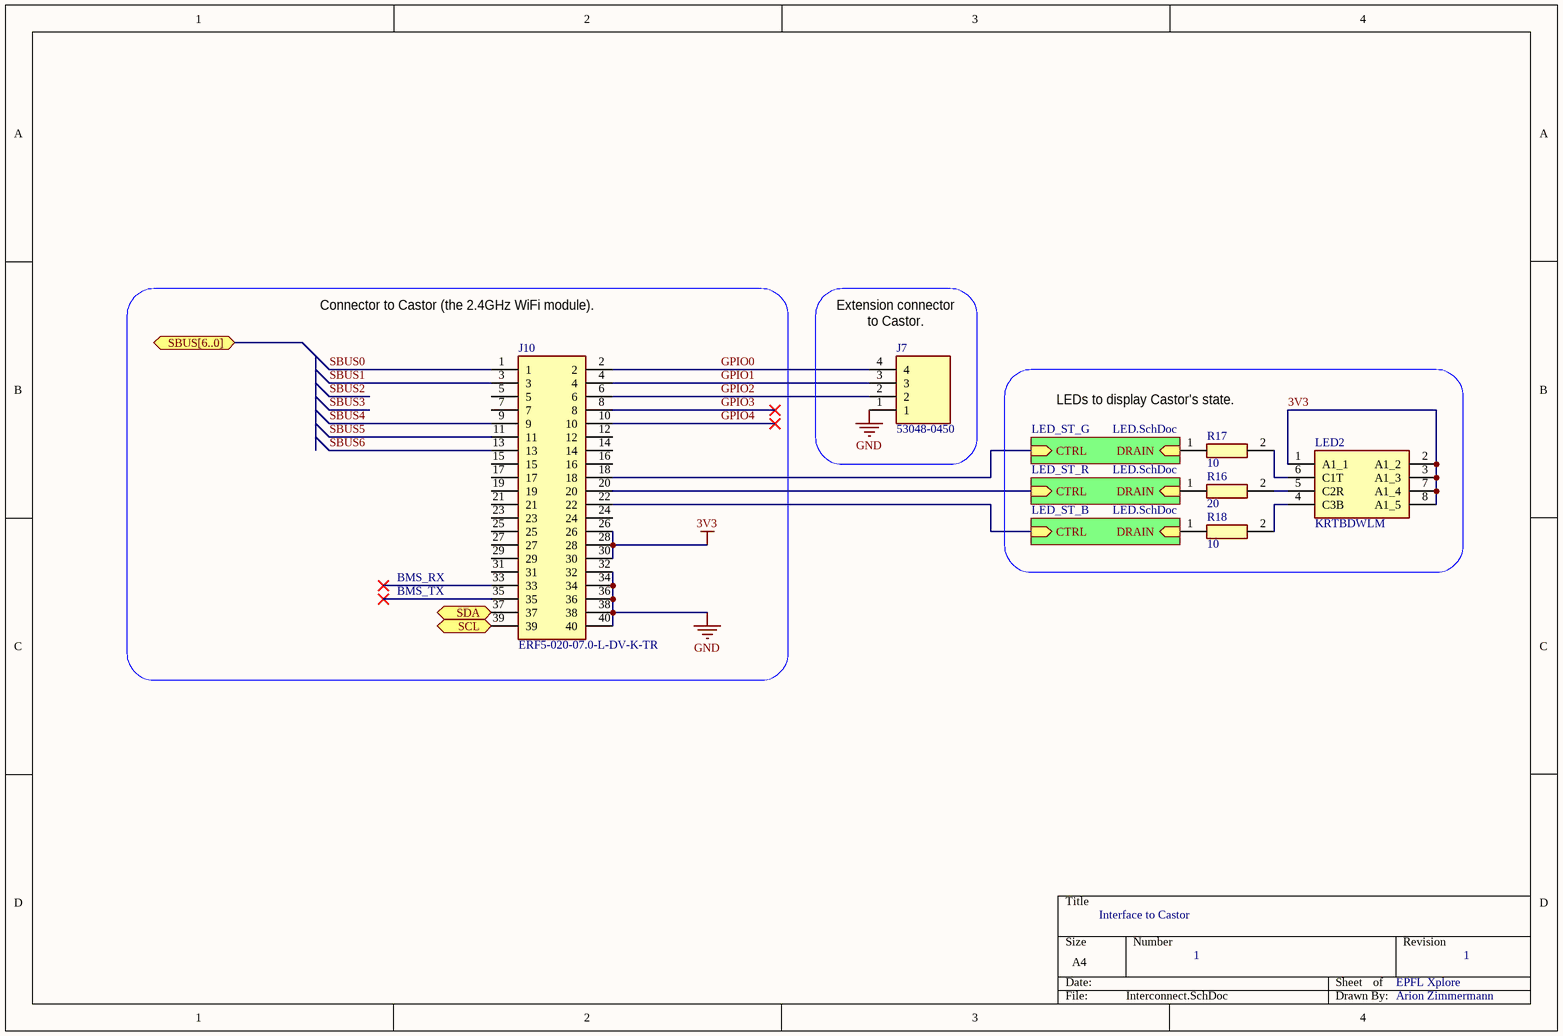
[diagram p11: Interconnect.SchDoc]

### Parts
J7  53048-0450  [SHDRRA4W35P0X125_1X4_675X550X350P]
J10  ERF5-020-07.0-L-DV-K-TR  [ERF5-020-XX.X-Y-DV-K-TR]
LED2  KRTBDWLM  [KRTBDWLM3232T4U6JWAAABJ3R4S65V]
R16  value 20  [RESC1608X55N]  (hidden comment: CRCW060320R0FKEAC)
R17  value 10  [RESC1608X55N]  (hidden comment: CRCW060310R0JNEAC)
R18  value 10  [RESC1608X55N]  (hidden comment: CRCW060310R0JNEAC)

### Sub-sheets
LED_ST_B = LED.SchDoc: CTRL (in), DRAIN (in)
LED_ST_G = LED.SchDoc: CTRL (in), DRAIN (in)
LED_ST_R = LED.SchDoc: CTRL (in), DRAIN (in)

### Ports
SBUS[6..0] (bidir), SCL (bidir), SDA (bidir)

### Nets
3V3: J10.26 J10.28 J10.30 LED2.1(A1_1) LED2.2(A1_2) LED2.3(A1_3) LED2.7(A1_4) LED2.8(A1_5)
GND: J7.1 J10.32 J10.34 J10.36 J10.38 J10.40
GPIO0: J7.4 J10.2
GPIO1: J7.3 J10.4
GPIO2: J7.2 J10.6
GPIO3: J10.8
GPIO4: J10.10
SBUS0: J10.1
SBUS1: J10.3
SBUS4: J10.9
SBUS5: J10.11
SBUS6: J10.13
SCL: J10.39 ; port SCL
SDA: J10.37 ; port SDA
NetJ10_18: J10.18 ; sheet LED_ST_G/CTRL
NetJ10_20: J10.20 ; sheet LED_ST_R/CTRL
NetJ10_22: J10.22 ; sheet LED_ST_B/CTRL
NetLED2_4: LED2.4(C3B) R18.2
NetLED2_5: LED2.5(C2R) R16.2
NetLED2_6: LED2.6(C1T) R17.2
NetQ5_LED_ST_B_3: R18.1 ; sheet LED_ST_B/DRAIN
NetQ5_LED_ST_G_3: R17.1 ; sheet LED_ST_G/DRAIN
NetQ5_LED_ST_R_3: R16.1 ; sheet LED_ST_R/DRAIN

Not connected (* = marked no-connect by the designer): J10 5 7 12 14 15 16 17 19 21 23 24 25 27 29 31 33* 35*

### Notes on the sheet
- (near J10) Connector to Castor (the 2.4GHz WiFi module).
- (near J7) Extension connector to Castor.
- (near R17) LEDs to display Castor's state.
- BMS_RX
- BMS_TX
- Interface to Castor
- 1
- EPFL Xplore
- Arion Zimmermann

### Library data of the parts
J7 = 53048-0450: Connector; Manufacturer_Name: Molex; Datasheet Link: https://www.molex.com/pdm_docs/sd/530480450_sd.pdf; Height: 3.5mm; Manufacturer_Part_Number: 53048-0450; Mouser Part Number: 538-53048-0450; Mouser Price/Stock: https://www.mouser.co.uk/ProductDetail/Molex/53048-0450?qs=0lSvoLzn4L%252Bhzo05ywM78Q%3D%3D
J10 = ERF5-020-07.0-L-DV-K-TR: Connector; Manufacturer_Name: SAMTEC; Datasheet Link: http://suddendocs.samtec.com/prints/erf5-xxx-xx.x-x-dv-xx-tr-mkt.pdf; Manufacturer_Part_Number: ERF5-020-07.0-L-DV-K-TR; Mouser Part Number: 200-ERF5020070LDVKTR; Mouser Price/Stock: https://www.mouser.co.uk/ProductDetail/Samtec/ERF5-020-070-L-DV-K-TR?qs=PB6%2FjmICvI2cw95I39aPSA%3D%3D; Arrow Part Number: ERF5-020-07.0-L-DV-K-TR; Arrow Price/Stock: https://www.arrow.com/en/products/erf5-020-07.0-l-dv-k-tr/samtec; System: Connector
LED2 = KRTBDWLM32.32-T4U6-JW+AAAB-J3+R4S6-5V: LED; Manufacturer_Name: OSRAM; Datasheet Link: https://dammedia.osram.info/media/resource/hires/osram-dam-12226989/KRTBDWLM32.32_EN.pdf; Height: 0.7mm; Manufacturer_Part_Number: KRTBDWLM32.32-T4U6-JW+AAAB-J3+R4S6-5V; Mouser Part Number: 720-KRTBDWLM323A7940; Mouser Price/Stock: https://www.mouser.co.uk/ProductDetail/OSRAM-Opto-Semiconductors/KRTBDWLM3232-T4U6-JW%2bAAAB-J3%2bR4S6-5V?qs=DPoM0jnrROWJ%2F8aeLsBacQ%3D%3D; Supplier 1: Mouser; Supplier Part Number 1: 720-KRTBDWLM323A7940
R16 = CRCW060320R0FKEAC: Resistor; Manufacturer_Name: Vishay; Datasheet Link: http://www.vishay.com/docs/28773/crcwce3.pdf; Height: 0.55mm; Manufacturer_Part_Number: CRCW060320R0FKEAC; Mouser Part Number: 71-CRCW060320R0FKEAC; Mouser Price/Stock: https://www.mouser.com/Search/Refine.aspx?Keyword=71-CRCW060320R0FKEAC; Arrow Part Number: CRCW060320R0FKEAC; Arrow Price/Stock: https://www.arrow.com/en/products/crcw060320r0fkeac/vishay; Supplier 1: Mouser; Supplier Part Number 1: 71-CRCW060320R0FKEAC
R17 R18 = CRCW060310R0FKEAC: Resistor; Manufacturer_Name: Vishay; Datasheet Link: https://ms.componentsearchengine.com/Datasheets/1/CRCW060310R0FKEAC.pdf; Height: 0.55mm; Manufacturer_Part_Number: CRCW060310R0FKEAC; Mouser Part Number: 71-CRCW060310R0FKEAC; Mouser Price/Stock: https://www.mouser.co.uk/ProductDetail/Vishay-Dale/CRCW060310R0FKEAC?qs=E3Y5ESvWgWP5XvJ40P8QAg%3D%3D; Arrow Part Number: CRCW060310R0FKEAC; Arrow Price/Stock: https://www.arrow.com/en/products/crcw060310r0fkeac/vishay; Supplier 1: Distrelec; Supplier Part Number 1: 16059657

## Sheet LED.SchDoc
size A4; SheetNumber: 11; SheetTotal: 15
Used 3 times, as channels Interconnect/LED_ST_R, Interconnect/LED_ST_G, Interconnect/LED_ST_B. Parts and nets are listed once, with the designators drawn on the sheet.
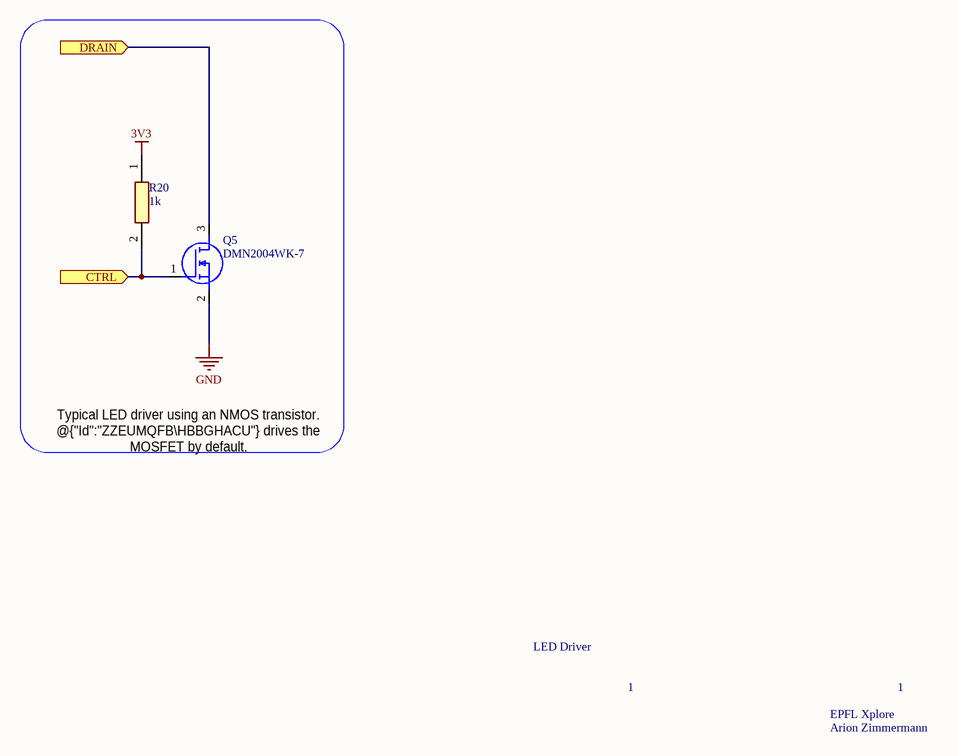
[diagram p12: LED.SchDoc]

### Parts
Q5  DMN2004WK-7  [SOT65P210X110-3N]
R20  value 1k  [RESC1608X55N]  (hidden comment: CRCW060349K9FKEAC)

### Ports
CTRL (in), DRAIN (in)

### Nets
3V3: R20.1
GND: Q5.2(S)
CTRL: Q5.1(G) R20.2 ; port CTRL
DRAIN: Q5.3(D) ; port DRAIN

### Channels
Interconnect/LED_ST_R: designators end in _LED_ST_R; ports CTRL=NetJ10_20 DRAIN=NetQ5_LED_ST_R_3
Interconnect/LED_ST_G: designators end in _LED_ST_G; ports CTRL=NetJ10_18 DRAIN=NetQ5_LED_ST_G_3
Interconnect/LED_ST_B: designators end in _LED_ST_B; ports CTRL=NetJ10_22 DRAIN=NetQ5_LED_ST_B_3

### Notes on the sheet
- Typical LED driver using an NMOS transistor. @{"Id":"ZZEUMQFB\HBBGHACU"} drives the MOSFET by default.
- LED Driver
- 1
- EPFL Xplore
- Arion Zimmermann

### Library data of the parts
Q5 = DMN2004WK-7: MOSFET (N-Channel); Manufacturer_Name: Diodes Inc.; Datasheet Link: https://www.arrow.com/en/products/dmn2004wk-7/diodes-incorporated; Height: 1.1mm; Manufacturer_Part_Number: DMN2004WK-7; Mouser Part Number: 621-DMN2004WK-7; Mouser Price/Stock: https://www.mouser.co.uk/ProductDetail/Diodes-Incorporated/DMN2004WK-7?qs=mQbszxtPdlNeJRFooqJmcQ%3D%3D; Arrow Part Number: DMN2004WK-7; Arrow Price/Stock: null?region=asia
R20 = CRCW06031K00JNEAC: Resistor; Manufacturer_Name: Vishay; Datasheet Link: http://www.vishay.com/docs/28773/crcwce3.pdf; Height: 0.55mm; Manufacturer_Part_Number: CRCW06031K00JNEAC; Mouser Part Number: 71-CRCW06031K00JNEAC; Mouser Price/Stock: https://www.mouser.co.uk/ProductDetail/Vishay-Dale/CRCW06031K00JNEAC?qs=E3Y5ESvWgWPM5t3DlmyFHQ%3D%3D; Arrow Part Number: CRCW06031K00JNEAC; Arrow Price/Stock: https://www.arrow.com/en/products/crcw06031k00jneac/vishay?region=nac

## Sheet Display.SchDoc
size A4; SheetNumber: 14; SheetTotal: 15
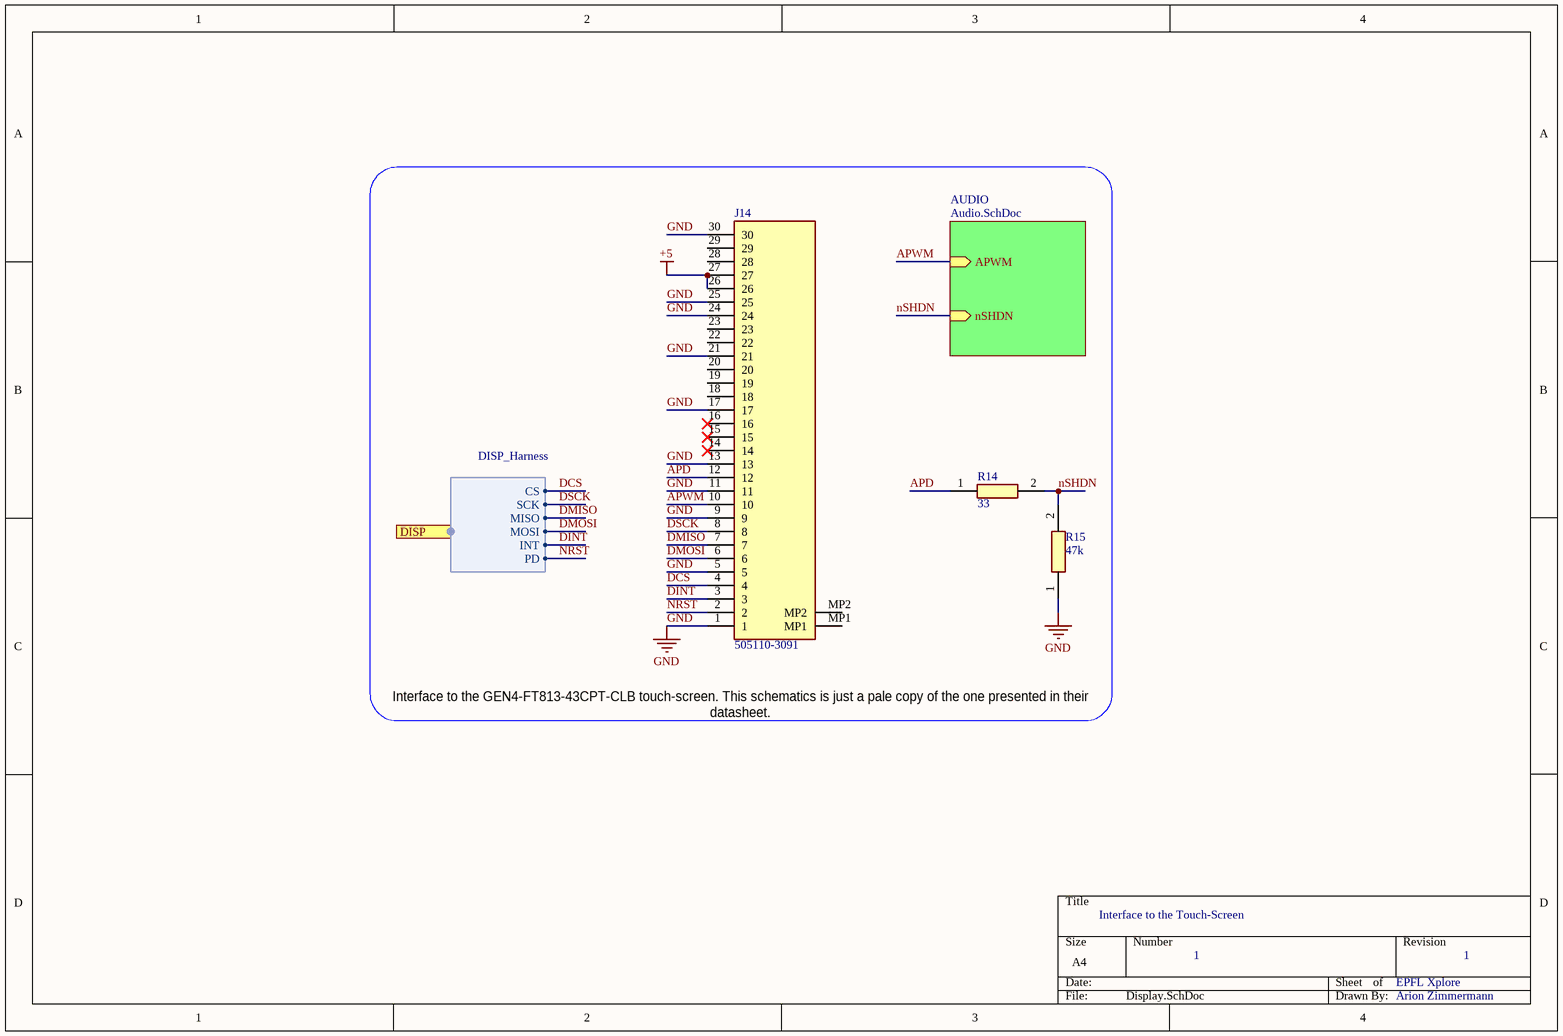
[diagram p13: Display.SchDoc]

### Parts
J14  505110-3091  [5051103091]
R14  value 33  [RESC1608X50N]  (hidden comment: CRCW060333R0JNEAC)
R15  value 47k  [RESC1608X50N]  (hidden comment: CRCW060347K0FKEAC)

### Sub-sheets
AUDIO = Audio.SchDoc: APWM (in), nSHDN (in)

### Ports
DISP (harness DISP_Harness)

### Harnesses
DISP_Harness: CS, MISO, SCK, MOSI, INT, PD

### Nets
+5: J14.26 J14.27
GND: J14.1 J14.5 J14.9 J14.11 J14.13 J14.17 J14.21 J14.24 J14.25 J14.30 R15.1
APD: J14.12 R14.1
APWM: J14.10 ; sheet AUDIO/APWM
DCS: J14.4 ; port DISP.CS
DINT: J14.3 ; port DISP.INT
DMISO: J14.7 ; port DISP.MISO
DMOSI: J14.6 ; port DISP.MOSI
DSCK: J14.8 ; port DISP.SCK
NRST: J14.2 ; port DISP.PD
nSHDN: R14.2 R15.2 ; sheet AUDIO/nSHDN

Not connected (* = marked no-connect by the designer): J14 14* 15* 16* 18 19 20 22 23 28 29 MP1 MP2

### Notes on the sheet
- Interface to the GEN4-FT813-43CPT-CLB touch-screen. This schematics is just a pale copy of the one presented in their datasheet.
- Interface to the Touch-Screen
- 1
- EPFL Xplore
- Arion Zimmermann

### Library data of the parts
J14 = 505110-3091: Connector; Manufacturer_Name: Molex; Datasheet Link: https://www.molex.com/pdm_docs/sd/5051103091_sd.pdf; Height: 2.1mm; Manufacturer_Part_Number: 505110-3091; Mouser Part Number: 538-505110-3091; Mouser Price/Stock: https://www.mouser.co.uk/ProductDetail/Molex/505110-3091?qs=fSIr1QPo%2F%2FSZ9fkf9Qvqqg%3D%3D
R14 R15 = CRCW0603931RFKEA: as R7 on sheet ControlUnit; Datasheet Link: http://www.vishay.com/docs/20035/dcrcwe3.pdf; Height: 0.5mm; Supplier 1: Mouser; Supplier Part Number 1: 71-CRCW06032K00JNEB